# EasyEDA Pro project 灰度传感器_2024-07-25.epro

# Schematic v1
Create Date: 2023-07-21; Page Name: P1; Project Name: 【2023电赛】2023年电赛控制术; Schematic Name: v1; Update Date: 2023-07-31; Company: 桂林信息科技学院; Drawed: Jsir2022; Page Size: A4; Reviewed: QQ1171690935; Version: V1
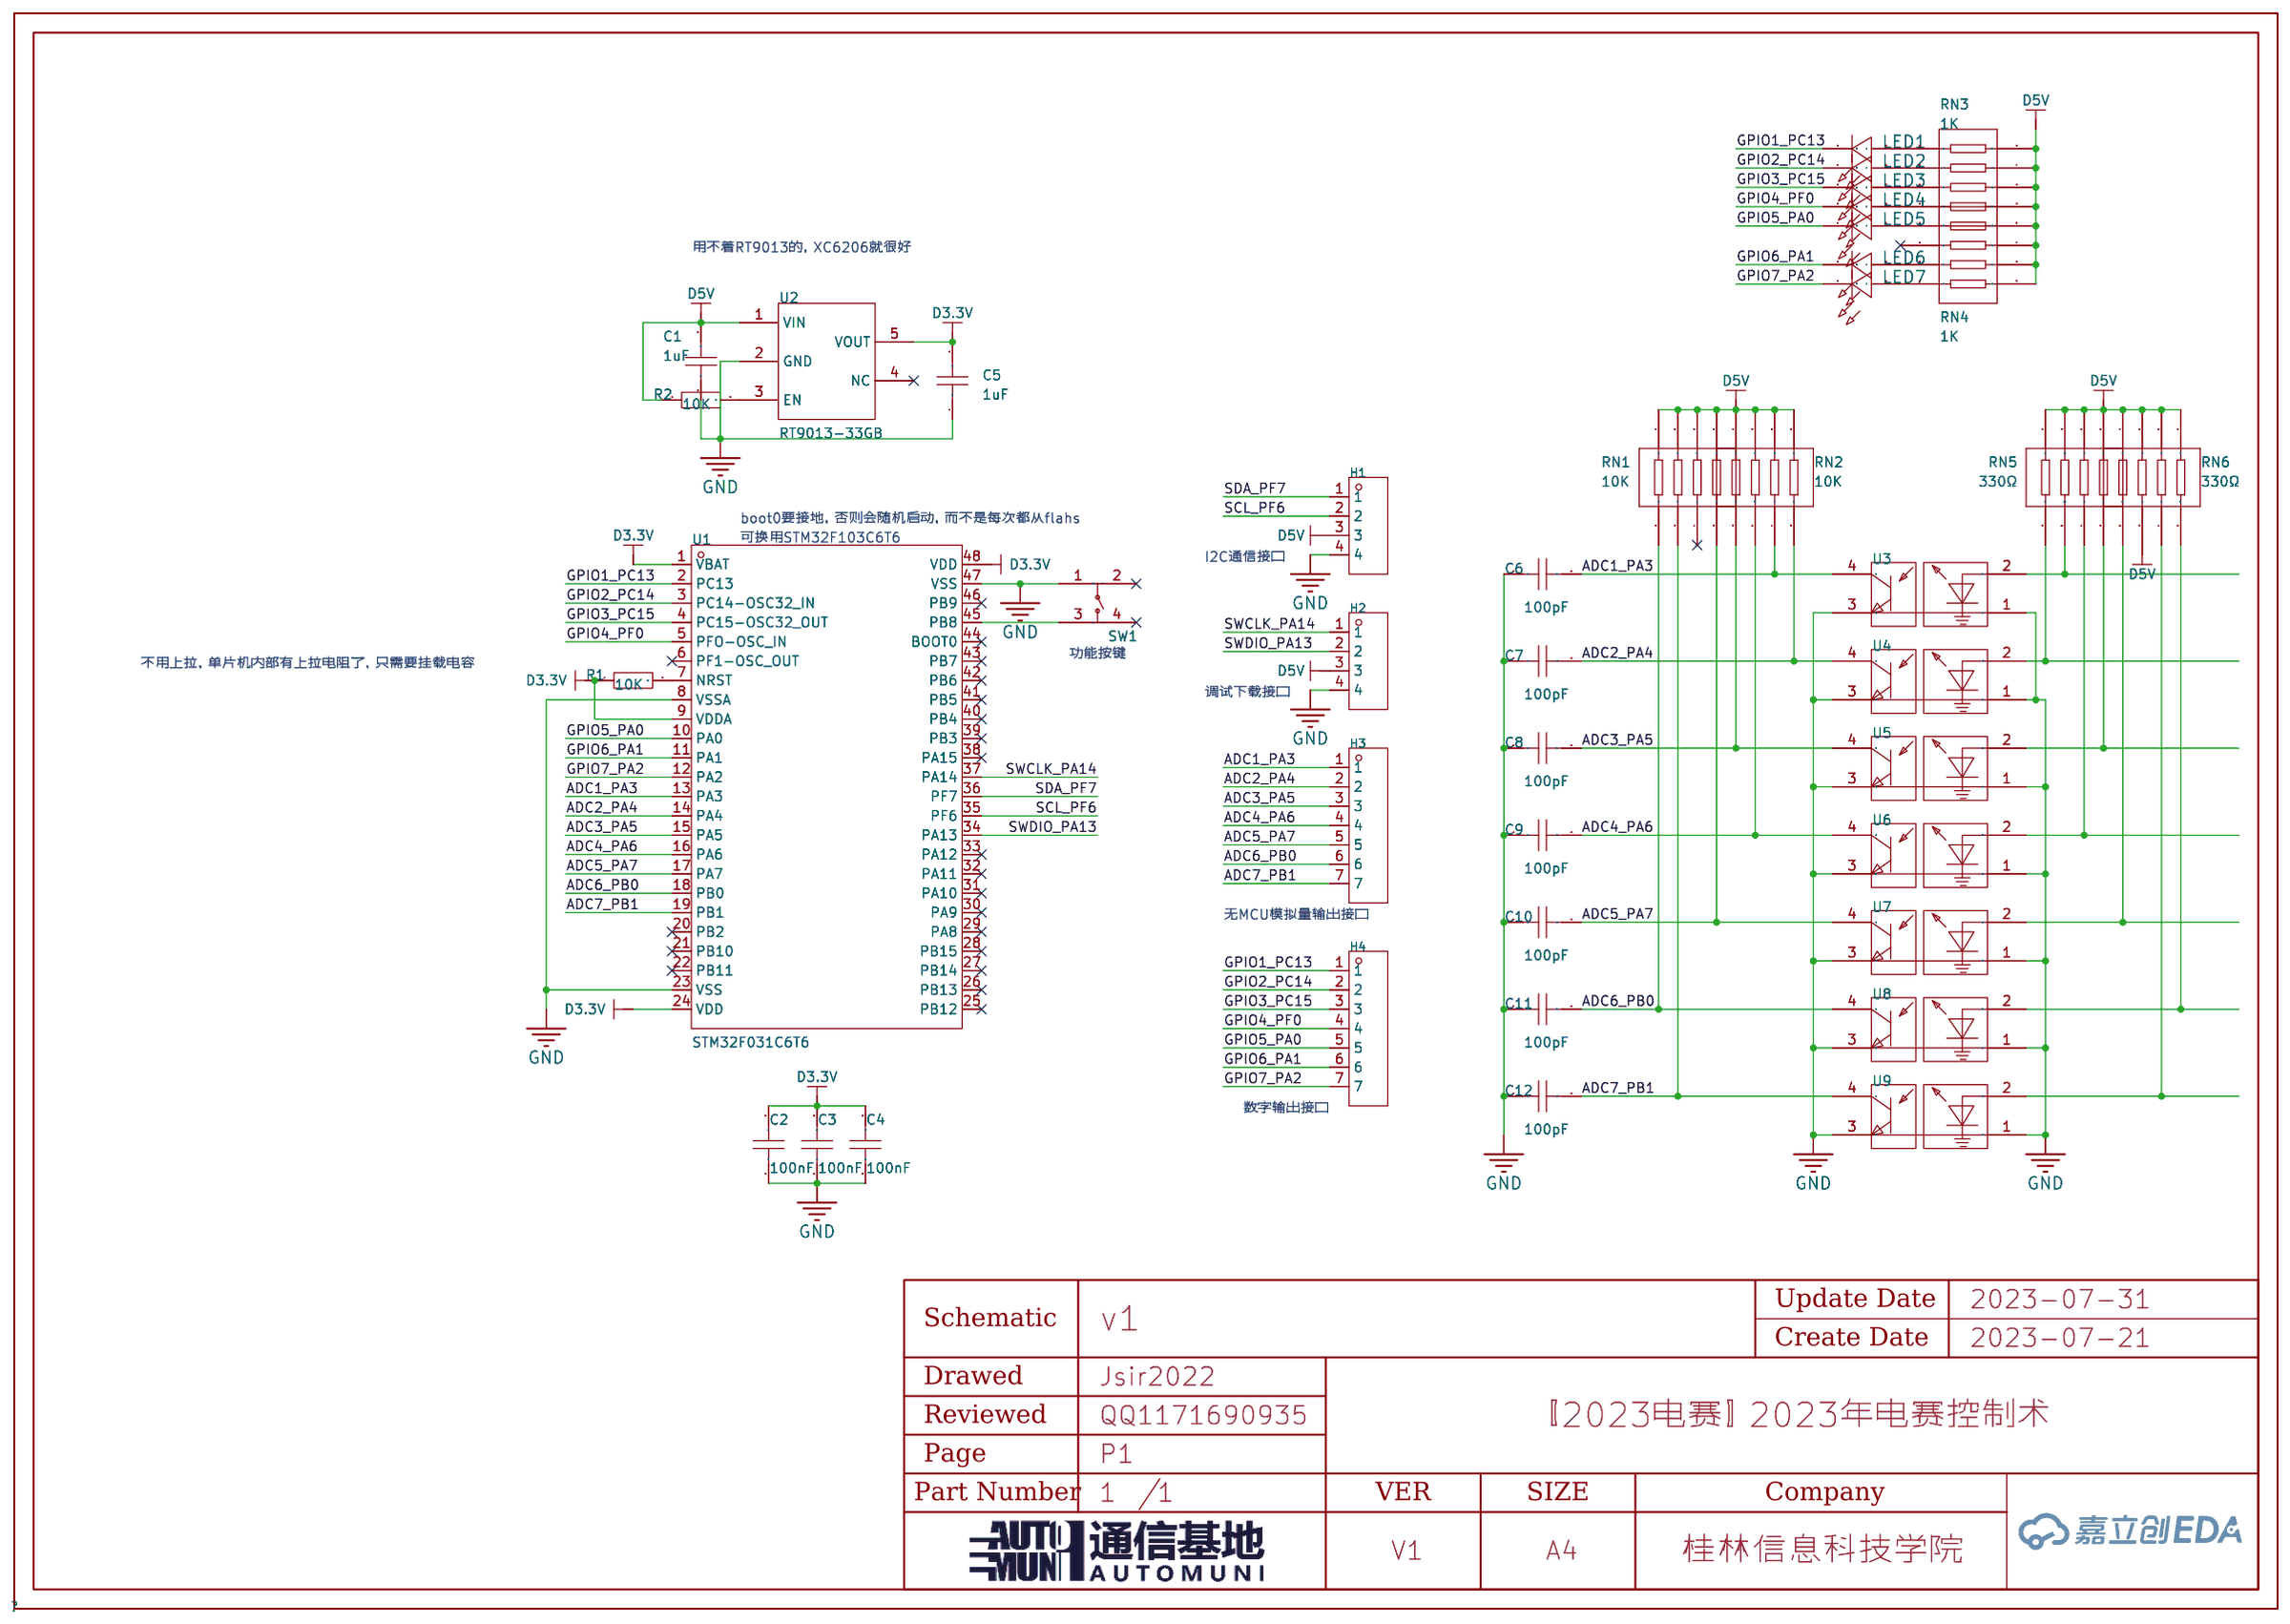
[diagram p0: schematic sheet]

## Parts
C1  1uF  [C0603]
C2  100nF  [C0603]
C3  100nF  [C0603]
C4  100nF  [C0603]
C5  1uF  [C0603]
C6  100pF  [C0603]
C7  100pF  [C0603]
C8  100pF  [C0603]
C9  100pF  [C0603]
C10  100pF  [C0603]
C11  100pF  [C0603]
C12  100pF  [C0603]
H1  -  [HDR-TH_4P-P2.54-V-M]
H2  -  [HDR-TH_4P-P2.54-V-M]
H3  -  [HDR-TH_7P-P2.54-V-M]
H4  -  [HDR-TH_7P-P2.54-V-M]
LED1  -  [LED_0603]
LED2  -  [LED_0603]
LED3  -  [LED_0603]
LED4  -  [LED_0603]
LED5  -  [LED_0603]
LED6  -  [LED_0603]
LED7  -  [LED_0603]
R1  10K  [R0603]
R2  10K  [R0603]
RN1  10K  [RES-ARRAY-SMD_0402-8P-L2.0-W1.0-BL]
RN2  10K  [RES-ARRAY-SMD_0402-8P-L2.0-W1.0-BL]
RN3  1K  [RES-ARRAY-SMD_0402-8P-L2.0-W1.0-BL]
RN4  1K  [RES-ARRAY-SMD_0402-8P-L2.0-W1.0-BL]
RN5  330Ω  [RES-ARRAY-SMD_0402-8P-L2.0-W1.0-BL]
RN6  330Ω  [RES-ARRAY-SMD_0402-8P-L2.0-W1.0-BL]
SW1  TS-1089S-AR02516  [SW-SMD_4P-L4.2-W3.3-P2.15-LS5.1]
U1  STM32F031C6T6  [LQFP-48_L7.0-W7.0-P0.50-LS9.0-BL]
U2  RT9013-33GB  [SOT-23-5_L3.0-W1.7-P0.95-LS2.8-BL]
U3  ITR9909  [OPTO-TH_ITR9909]
U4  ITR9909  [OPTO-TH_ITR9909]
U5  ITR9909  [OPTO-TH_ITR9909]
U6  ITR9909  [OPTO-TH_ITR9909]
U7  ITR9909  [OPTO-TH_ITR9909]
U8  ITR9909  [OPTO-TH_ITR9909]
U9  ITR9909  [OPTO-TH_ITR9909]

## Library data of the parts
C1-C12 = CAP_0603: Supplier Footprint: 0603
H1 H2 = HDR-M_2.54_1x4P: Supplier Part: C492403; Supplier Footprint: 插件
H3 H4 = HDR-M_2.54_1x7P: Supplier Part: C492406; Supplier Footprint: 插件
LED1-LED7 = LED_0603-R: Supplier Footprint: 0603
R1 R2 = Res_0603: Supplier Footprint: 0603
RN1-RN6 = YC124-JR-07330RL: 阻值:330Ω;精度:±5%;单个元件功率:62.5mW;电阻器数:4;; LCSC Part Name: 330Ω ±5% 0402x4; Supplier Part: C136846; Manufacturer: YAGEO(国巨); Supplier Footprint: 0402x4; JLCPCB Part Class: Extended Part; Datasheet: https://atta.szlcsc.com/upload/public/pdf/source/20171106/C136846_15099533593141092631.pdf; Supplier: LCSC; Tolerance: ±5%; Power(Watts): 62.5mW; Number of Resistors: 4; Number of Pins: 8; Temperature Coefficient: ±200ppm/℃
SW1 = TS-1089S-AR02516: 触点电流:50mA;额定电压(DC):12V;绝缘电阻:100MΩ;电路结构:单刀单掷;安装方式:立贴;按钮形状:椭圆形按钮;按钮/盖帽颜色:白色;作用力:160gf@±50gf;机械寿命:100000;工作温度:-30~+80;引脚样式:SMD接片;开关长度:4.2mm;开关宽度:3.25mm;开关高度:2.5mm;带支架:否;; LCSC Part Name: 342.5 160gf 轻触开关; Supplier Part: C720479; Manufacturer: XUNPU(讯普); Supplier Footprint: SMD; JLCPCB Part Class: Extended Part; Datasheet: https://atta.szlcsc.com/upload/public/pdf/source/20200810/C720479_389650BB8B865DD3822BD59B78D6CF64.pdf; Supplier: LCSC; Contact Current: 50mA; Voltage Rating (DC): 12V; Insulation Resistance: 100MΩ; Circuit: 单刀单掷; Mounting Style: 立贴; Actuator Style: 椭圆形按钮; Actuator/Cap Color: 白色; Operating Force: 160gf@±50gf; Mechanical Life: 100000; Operating Temperature: -30~+80; Pin Style: SMD接片; Switch Length: 4.2mm; Switch Width: 3.25mm; Switch Height: 2.5mm; Strike Gundam: 否
U1 = STM32F031C6T6: CPU内核:ARM Cortex-M0;CPU最大主频:48MHz;工作电压范围:2V~3.6V;内部振荡器:有;程序 FLASH容量:32K@x8bit;RAM总容量:4KB;EEPROM/数据 FLASH容量:-;GPIO端口数量:39;ADC(单元数/通道数/位数):1@x13ch/12bit;外设/功能/协议栈:DMA；看门狗；POR；PWM;工作温度范围:-40℃~+85℃;; LCSC Part Name: ARM Cortex-M0 48MHz 闪存：32K@x8bit RAM：4KB; Supplier Part: C97413; Manufacturer: ST(意法半导体); Supplier Footprint: LQFP-48(7x7); JLCPCB Part Class: Extended Part; Datasheet: https://atta.szlcsc.com/upload/public/pdf/source/20170925/C97413_1506321779757990583.pdf; Supplier: LCSC; CPU Core: ARM Cortex-M0; Maximum Frequency: 48MHz; Supply Voltage Range: 2V~3.6V; Internal Oscillator: 有; Program FLASH Size: 32K@x8bit; RAM Size: 4KB; GPIO Ports Number: 39; ADC (Units/Channels/bits): 1@x13ch/12bit; Peripherals / Functions / Protocol Stacks: DMA；看门狗；POR；PWM; Operating Temperature Range: -40℃~+85℃
U2 = RT9013-33GB: 输出类型:固定;输出极性:正;最大输入电压:5.5V;输出电压:3.3V;输出电流:500mA;电源纹波抑制比(PSRR):50dB@(10kHz);; Supplier Part: C47773; Manufacturer: RICHTEK(立锜); Supplier Footprint: SOT-23-5; JLCPCB Part Class: 扩展库; Datasheet: https://atta.szlcsc.com/upload/public/pdf/source/20150504/1457707282459.pdf; Supplier: LCSC; Output Type: 固定; Output Polarity: 正; Number of Outputs: 1; Maximum Input Voltage: 5.5V; Output Voltage: 3.3V; Dropout Voltage: 400mV@(500mA); Output Current: 500mA; Power Supply Rejection Ratio (PSRR): 50dB@(10kHz)
U3-U9 = ITR9909: Supplier Part: C53399; Manufacturer: EVERLIGHT(台湾亿光); Supplier Footprint: DIP-4; JLCPCB Part Class: Extended Part; Datasheet: https://atta.szlcsc.com/upload/public/pdf/source/20201022/C53399_E5C79523D84B21DC4419F8E709CCCF2E.pdf; Supplier: LCSC

## Nets
D3.3V: C2.2 C3.2 C4.2 C5.2 R1.1 U1.1(VBAT) U1.9(VDDA) U1.24(VDD) U1.48(VDD) U2.5(VOUT)
D5V: C1.2 H1.3 H2.3 R2.1 RN1.1 RN1.2 RN1.3 RN1.4 RN2.1 RN2.2 RN2.3 RN2.4 RN3.5 RN3.6 RN3.7 RN3.8 RN4.5 RN4.6 RN4.7 RN4.8 RN5.1 RN5.2 RN5.3 RN5.4 RN6.1 RN6.2 RN6.3 RN6.4 RN6.6 U2.1(VIN)
GND: C1.1 C2.1 C3.1 C4.1 C5.1 C6.1 C7.1 C8.1 C9.1 C10.1 C11.1 C12.1 H1.4 H2.4 SW1.1 U1.8(VSSA) U1.23(VSS) U1.47(VSS) U2.2(GND) U3.1 U3.3 U4.1 U4.3 U5.1 U5.3 U6.1 U6.3 U7.1 U7.3 U8.1 U8.3 U9.1 U9.3
ADC1_PA3: C6.2 H3.1 RN2.7 U1.13(PA3) U3.4
ADC2_PA4: C7.2 H3.2 RN2.8 U1.14(PA4) U4.4
ADC3_PA5: C8.2 H3.3 RN2.5 U1.15(PA5) U5.4
ADC4_PA6: C9.2 H3.4 RN2.6 U1.16(PA6) U6.4
ADC5_PA7: C10.2 H3.5 RN1.8 U1.17(PA7) U7.4
ADC6_PB0: C11.2 H3.6 RN1.5 U1.18(PB0) U8.4
ADC7_PB1: C12.2 H3.7 RN1.6 U1.19(PB1) U9.4
GPIO1_PC13: H4.1 LED1.1(C) U1.2(PC13)
GPIO2_PC14: H4.2 LED2.1(C) U1.3(PC14-OSC32_IN)
GPIO3_PC15: H4.3 LED3.1(C) U1.4(PC15-OSC32_OUT)
GPIO4_PF0: H4.4 LED4.1(C) U1.5(PFO-OSC_IN)
GPIO5_PA0: H4.5 LED5.1(C) U1.10(PA0)
GPIO6_PA1: H4.6 LED6.1(C) U1.11(PA1)
GPIO7_PA2: H4.7 LED7.1(C) U1.12(PA2)
SCL_PF6: H1.2 U1.35(PF6)
SDA_PF7: H1.1 U1.36(PF7)
SWCLK_PA14: H2.1 U1.37(PA14)
SWDIO_PA13: H2.2 U1.34(PA13)
$1N2447: R1.2 U1.7(NRST)
$1N4175: LED1.2(A) RN3.1
$1N4229: LED2.2(A) RN3.2
$1N4256: LED3.2(A) RN3.3
$1N4283: LED4.2(A) RN3.4
$1N4310: LED5.2(A) RN4.1
$1N5229: SW1.3 U1.45(PB8)
$1N5545: R2.2 U2.3(EN)
$1N6315: RN5.7 U6.2
$1N6322: RN5.8 U5.2
$1N6336: RN5.5 U4.2
$1N6418: RN5.6 U3.2
$1N6450: RN6.5 U7.2
$1N6471: RN6.8 U8.2
$1N6478: RN6.7 U9.2
$1N6514: LED7.2(A) RN4.4
$1N6542: LED6.2(A) RN4.3

Not connected (* = marked no-connect by the designer): RN1 7*; RN4 2*; SW1 2* 4*; U1 6(PF1-OSC_OUT)* 20(PB2)* 21(PB10)* 22(PB11)* 25(PB12)* 26(PB13)* 27(PB14)* 28(PB15)* 29(PA8)* 30(PA9)* 31(PA10)* 32(PA11)* 33(PA12)* 38(PA15)* 39(PB3)* 40(PB4)* 41(PB5)* 42(PB6)* 43(PB7)* 44(BOOT0)* 46(PB9)*; U2 4(NC)*

## Notes on the sheet
- 用不着RT9013的，XC6206就很好
- boot0要接地，否则会随机启动，而不是每次都从flahs
- 可换用STM32F103C6T6
- I2C通信接口
- 功能按键
- 不用上拉，单片机内部有上拉电阻了，只需要挂载电容
- 调试下载接口
- 无MCU模拟量输出接口
- 数字输出接口

# Schematic Schematic1
Create Date: 2024-07-11; Page Name: P1; Project Name: 灰度传感器; Schematic Name: Schematic1; Update Date: 2024-07-16; Company: 桂林信息科技学院; Drawed: Jsir2022; Page Size: A4; Reviewed: QQ1171690935; Version: V1
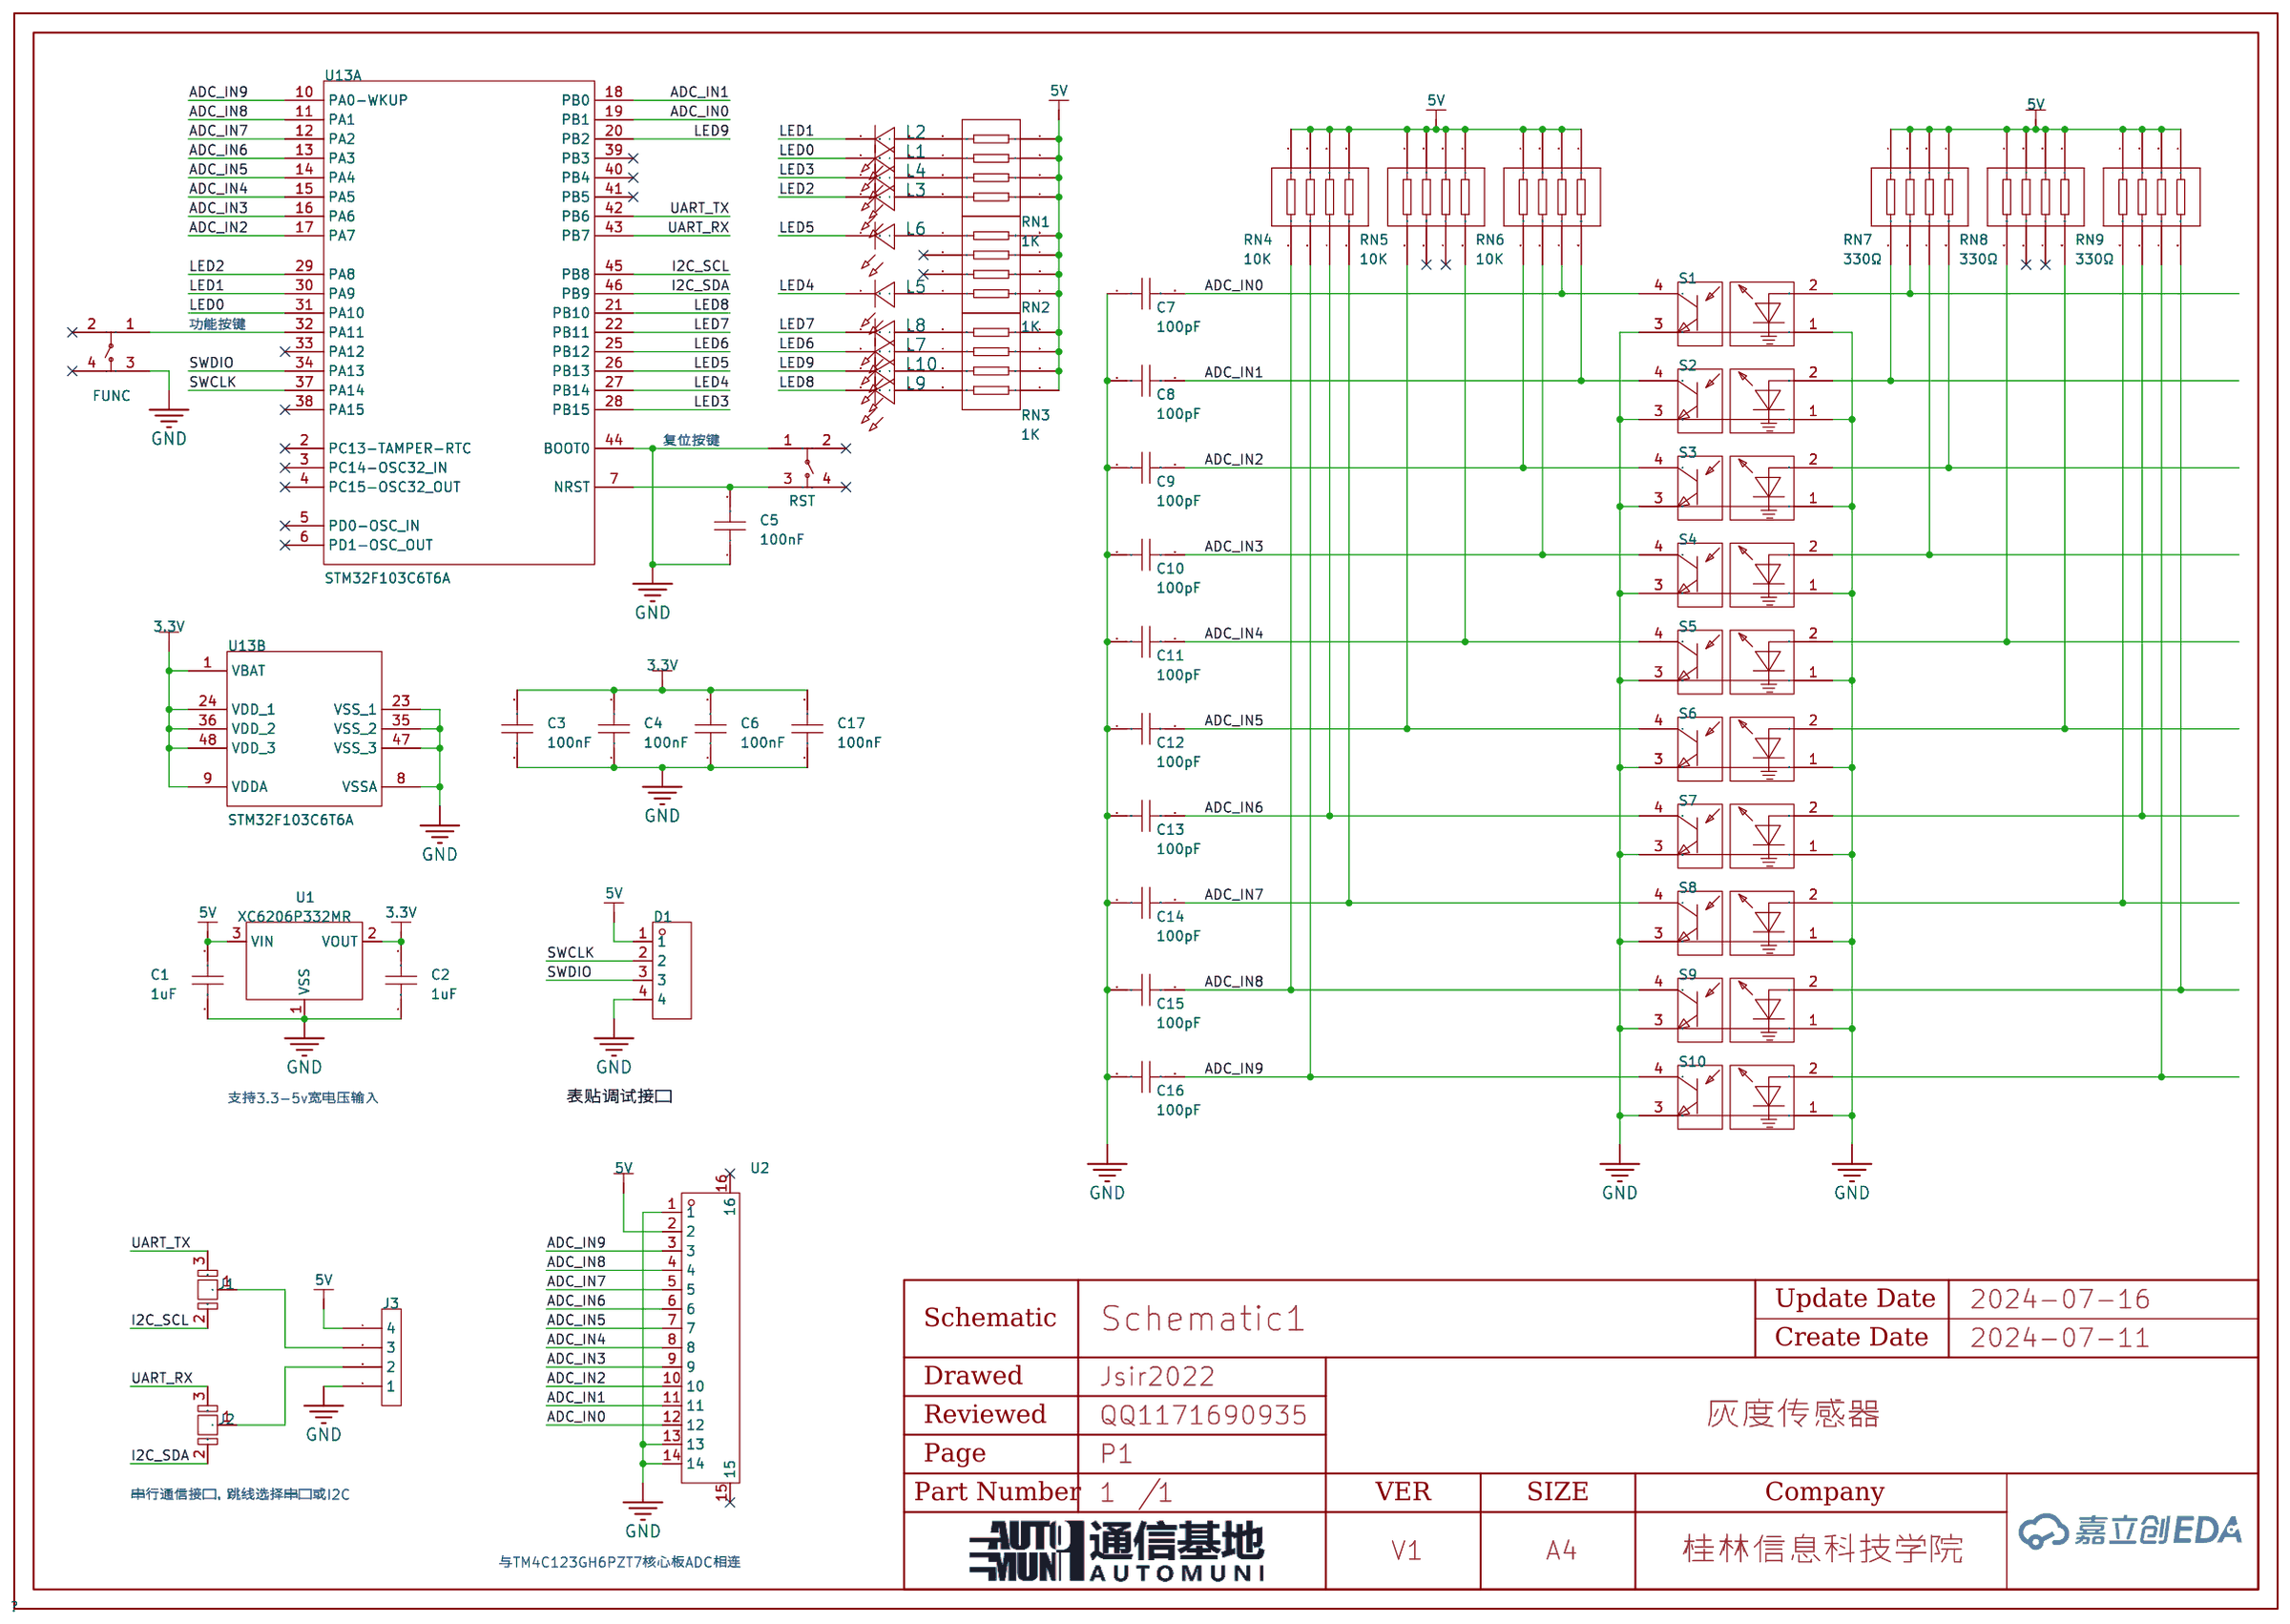
[diagram p1: schematic sheet]

## Parts
C1  1uF  [C0603]
C2  1uF  [C0603]
C3  100nF  [C0603]
C4  100nF  [C0603]
C5  100nF  [C0603]
C6  100nF  [C0603]
C7  100pF  [C0603]
C8  100pF  [C0603]
C9  100pF  [C0603]
C10  100pF  [C0603]
C11  100pF  [C0603]
C12  100pF  [C0603]
C13  100pF  [C0603]
C14  100pF  [C0603]
C15  100pF  [C0603]
C16  100pF  [C0603]
C17  100nF  [C0603]
D1  -  [2.54 4p 下载触点]
FUNC  TS-1089S-AR02516  [SW-SMD_4P-L4.2-W3.3-P2.15-LS5.1]
J1  -  [跳线焊盘3p]
J2  -  [跳线焊盘3p]
J3  -  [2.54 4P SMD]
L1  -  [LED_0603]
L2  -  [LED_0603]
L3  -  [LED_0603]
L4  -  [LED_0603]
L5  -  [LED_0603]
L6  -  [LED_0603]
L7  -  [LED_0603]
L8  -  [LED_0603]
L9  -  [LED_0603]
L10  -  [LED_0603]
RN1  1K  [RES-ARRAY-SMD_0402-8P-L2.0-W1.0-BL]
RN2  1K  [RES-ARRAY-SMD_0402-8P-L2.0-W1.0-BL]
RN3  1K  [RES-ARRAY-SMD_0402-8P-L2.0-W1.0-BL]
RN4  10K  [RES-ARRAY-SMD_0402-8P-L2.0-W1.0-BL]
RN5  10K  [RES-ARRAY-SMD_0402-8P-L2.0-W1.0-BL]
RN6  10K  [RES-ARRAY-SMD_0402-8P-L2.0-W1.0-BL]
RN7  330Ω  [RES-ARRAY-SMD_0402-8P-L2.0-W1.0-BL]
RN8  330Ω  [RES-ARRAY-SMD_0402-8P-L2.0-W1.0-BL]
RN9  330Ω  [RES-ARRAY-SMD_0402-8P-L2.0-W1.0-BL]
RST  TS-1089S-AR02516  [SW-SMD_4P-L4.2-W3.3-P2.15-LS5.1]
S1  ITR9909  [OPTO-TH_ITR9909]
S2  ITR9909  [OPTO-TH_ITR9909]
S3  ITR9909  [OPTO-TH_ITR9909]
S4  ITR9909  [OPTO-TH_ITR9909]
S5  ITR9909  [OPTO-TH_ITR9909]
S6  ITR9909  [OPTO-TH_ITR9909]
S7  ITR9909  [OPTO-TH_ITR9909]
S8  ITR9909  [OPTO-TH_ITR9909]
S9  ITR9909  [OPTO-TH_ITR9909]
S10  ITR9909  [OPTO-TH_ITR9909]
U1  XC6206P332MR  [SOT-23-3_L2.9-W1.3-P1.90-LS2.4-BR]
U2  FPC-1.0FX-14PWCR-H20  [FPC-SMD_XUNPU_FPC-1.0FX-14PWCR-H20]
U13  STM32F103C6T6A  [LQFP-48_L7.0-W7.0-P0.50-LS9.0-BL]  (sections 1,2)

## Library data of the parts
C1-C17 = CAP_0603: Supplier Footprint: 0603
D1 = 2.54 4p 下载触点
FUNC RST = TS-1089S-AR02516: 触点电流:50mA;额定电压(DC):12V;绝缘电阻:100MΩ;电路结构:单刀单掷;安装方式:立贴;按钮形状:椭圆形按钮;按钮/盖帽颜色:白色;作用力:160gf@±50gf;机械寿命:100000;工作温度:-30~+80;引脚样式:SMD接片;开关长度:4.2mm;开关宽度:3.25mm;开关高度:2.5mm;带支架:否;; LCSC Part Name: 342.5 160gf 轻触开关; Supplier Part: C720479; Manufacturer: XUNPU(讯普); Supplier Footprint: SMD; JLCPCB Part Class: Extended Part; Datasheet: https://atta.szlcsc.com/upload/public/pdf/source/20200810/C720479_389650BB8B865DD3822BD59B78D6CF64.pdf; Supplier: LCSC; Contact Current: 50mA; Voltage Rating (DC): 12V; Insulation Resistance: 100MΩ; Circuit: 单刀单掷; Mounting Style: 立贴; Actuator Style: 椭圆形按钮; Actuator/Cap Color: 白色; Operating Force: 160gf@±50gf; Mechanical Life: 100000; Operating Temperature: -30~+80; Pin Style: SMD接片; Switch Length: 4.2mm; Switch Width: 3.25mm; Switch Height: 2.5mm; Strike Gundam: 否
J1 J2 = 跳线焊盘3P
J3 = 2.54 4P排针表贴
L1-L10 = LED_0603-R: Supplier Footprint: 0603
RN1-RN9 = YC124-JR-07330RL: 阻值:330Ω;精度:±5%;单个元件功率:62.5mW;电阻器数:4;; LCSC Part Name: 330Ω ±5% 0402x4; Supplier Part: C136846; Manufacturer: YAGEO(国巨); Supplier Footprint: 0402x4; JLCPCB Part Class: Extended Part; Datasheet: https://atta.szlcsc.com/upload/public/pdf/source/20171106/C136846_15099533593141092631.pdf; Supplier: LCSC; Tolerance: ±5%; Power(Watts): 62.5mW; Number of Resistors: 4; Number of Pins: 8; Temperature Coefficient: ±200ppm/℃
S1-S10 = ITR9909: Supplier Part: C53399; Manufacturer: EVERLIGHT(台湾亿光); Supplier Footprint: DIP-4; JLCPCB Part Class: Extended Part; Datasheet: https://atta.szlcsc.com/upload/public/pdf/source/20201022/C53399_E5C79523D84B21DC4419F8E709CCCF2E.pdf; Supplier: LCSC
U1 = XC6206P332MR_C5148692: 输出类型:固定;最大输入电压:8V;输出电压:3.3V;最大输出电流:300mA;输出极性:正极;; LCSC Part Name: 输入8V 输出3.3V 300mA; Supplier Part: C5148692; Manufacturer: HXY MOSFET(华轩阳电子); Supplier Footprint: SOT-23; JLCPCB Part Class: 扩展库; Datasheet: https://atta.szlcsc.com/upload/public/pdf/source/20230315/7D5B35EFFBBF81C2EFC36318D2A1A670.pdf; Supplier: LCSC; Output Type: 固定; Maximum Input Voltage: 8V; Output Voltage: 3.3V; MAX Output Current: 300mA; Dropout Voltage: 240mV@(50mA); Output Polarity: 正极; Number of Outputs: 1
U2 = FPC-1.0FX-14PWCR-H20: 锁定特性:翻盖式;触点类型:下接;触点数量:14P;间距:1mm;安装类型:卧贴;; LCSC Part Name: 间距:1mm P数:14P 翻盖式 下接; Supplier Part: C19269357; Manufacturer: XUNPU(讯普); Supplier Footprint: SMD,P=1mm,卧贴; JLCPCB Part Class: 扩展库; Datasheet: https://atta.szlcsc.com/upload/public/pdf/source/20231121/46D1D420E162B395A0FFF09C3BB98E72.pdf; Supplier: LCSC; Locking Feature: 翻盖式; Contact Type: 下接; Number of Contacts: 14P; Pitch: 1mm; Mounting Type: 卧贴; Height Above Board: 2mm
U13 = STM32F103C6T6A: CPU内核:CM3;程序存储容量:32KB;RAM总容量:10KB;GPIO端口数量:37;工作电压范围:2V~3.6V;CPU最大主频:72MHz;程序存储器类型:FLASH;; Supplier Part: C8303; Manufacturer: ST(意法半导体); Supplier Footprint: LQFP-48(7x7); JLCPCB Part Class: 扩展库; Datasheet: https://atta.szlcsc.com/upload/public/pdf/source/20140724/1457707171306.pdf; Supplier: LCSC; CPU Core: CM3; Program Storage Size: 32KB; RAM Size: 10KB; GPIO Ports Number: 37; Operating Voltage Range: 2V~3.6V; CPU Maximum Speed: 72MHz; Program Memory Type: FLASH; Operating Temperature Range: -40℃~+85℃; ADC (Bit): 12bit; Universal Serial Bus: 有; Peripheral/Function: DMA；片载温度传感器；PWM; Watchdog: 有; Infrared Data Association: 有; Low-Voltage Detect: 有; Direct Memory Access: 有; Internal Oscillator: 有

## Nets
3.3V: C2.2 C3.2 C4.2 C6.2 C17.2 U1.2(VOUT) U13.1(VBAT) U13.9(VDDA) U13.24(VDD_1) U13.36(VDD_2) U13.48(VDD_3)
5V: C1.2 D1.1 J3.4 RN1.1 RN1.2 RN1.3 RN1.4 RN2.5 RN2.6 RN2.7 RN2.8 RN3.1 RN3.2 RN3.3 RN3.4 RN4.1 RN4.2 RN4.3 RN4.4 RN5.1 RN5.2 RN5.3 RN5.4 RN6.1 RN6.2 RN6.3 RN6.4 RN7.1 RN7.2 RN7.3 RN7.4 RN8.1 RN8.2 RN8.3 RN8.4 RN9.1 RN9.2 RN9.3 RN9.4 U1.3(VIN) U2.2
GND: C1.1 C2.1 C3.1 C4.1 C5.1 C6.1 C7.1 C8.1 C9.1 C10.1 C11.1 C12.1 C13.1 C14.1 C15.1 C16.1 C17.1 D1.4 FUNC.3 J3.1 RST.1 S1.1 S1.3 S2.1 S2.3 S3.1 S3.3 S4.1 S4.3 S5.1 S5.3 S6.1 S6.3 S7.1 S7.3 S8.1 S8.3 S9.1 S9.3 S10.1 S10.3 U1.1(VSS) U2.1 U2.13 U2.14 U13.8(VSSA) U13.23(VSS_1) U13.35(VSS_2) U13.44(BOOT0) U13.47(VSS_3)
ADC_IN0: C7.2 RN6.7 S1.4 U2.12 U13.19(PB1)
ADC_IN1: C8.2 RN6.8 S2.4 U2.11 U13.18(PB0)
ADC_IN2: C9.2 RN6.5 S3.4 U2.10 U13.17(PA7)
ADC_IN3: C10.2 RN6.6 S4.4 U2.9 U13.16(PA6)
ADC_IN4: C11.2 RN5.8 S5.4 U2.8 U13.15(PA5)
ADC_IN5: C12.2 RN5.5 S6.4 U2.7 U13.14(PA4)
ADC_IN6: C13.2 RN4.7 S7.4 U2.6 U13.13(PA3)
ADC_IN7: C14.2 RN4.8 S8.4 U2.5 U13.12(PA2)
ADC_IN8: C15.2 RN4.5 S9.4 U2.4 U13.11(PA1)
ADC_IN9: C16.2 RN4.6 S10.4 U2.3 U13.10(PA0-WKUP)
I2C_SCL: J1.2 U13.45(PB8)
I2C_SDA: J2.2 U13.46(PB9)
LED0: L1.1(C) U13.31(PA10)
LED1: L2.1(C) U13.30(PA9)
LED2: L3.1(C) U13.29(PA8)
LED3: L4.1(C) U13.28(PB15)
LED4: L5.1(C) U13.27(PB14)
LED5: L6.1(C) U13.26(PB13)
LED6: L7.1(C) U13.25(PB12)
LED7: L8.1(C) U13.22(PB11)
LED8: L9.1(C) U13.21(PB10)
LED9: L10.1(C) U13.20(PB2)
SWCLK: D1.2 U13.37(PA14)
SWDIO: D1.3 U13.34(PA13)
UART_RX: J2.3 U13.43(PB7)
UART_TX: J1.3 U13.42(PB6)
$1N7041: C5.2 RST.3 U13.7(NRST)
$1N7104: FUNC.1 U13.32(PA11)
$1N7880: J2.1 J3.2
$1N7885: J1.1 J3.3
$1N11035: RN8.8 S6.2
$1N11042: RN8.5 S5.2
$1N11122: RN9.5 S8.2
$1N11129: RN9.6 S7.2
$1N11138: RN9.7 S10.2
$1N11160: RN9.8 S9.2
$1N11201: RN7.5 S2.2
$1N11208: RN7.6 S1.2
$1N11217: RN7.7 S4.2
$1N11224: RN7.8 S3.2
$1N12791: L2.2(A) RN1.8
$1N12820: L1.2(A) RN1.7
$1N12849: L3.2(A) RN1.5
$1N12851: L4.2(A) RN1.6
$1N12907: L6.2(A) RN2.1
$1N12909: L5.2(A) RN2.4
$1N13108: L7.2(A) RN3.7
$1N13110: L8.2(A) RN3.8
$1N13112: L9.2(A) RN3.5
$1N13114: L10.2(A) RN3.6

Not connected (* = marked no-connect by the designer): FUNC 2* 4*; RN2 2* 3*; RN5 6* 7*; RN8 6* 7*; RST 2* 4*; U2 15* 16*; U13 2(PC13-TAMPER-RTC)* 3(PC14-OSC32_IN)* 4(PC15-OSC32_OUT)* 5(PD0-OSC_IN)* 6(PD1-OSC_OUT)* 33(PA12)* 38(PA15)* 39(PB3)* 40(PB4)* 41(PB5)*

## Notes on the sheet
- 功能按键
- 复位按键
- 支持3.3-5v宽电压输入
- 表贴调试接口
- 串行通信接口，跳线选择串口或I2C
- 与TM4C123GH6PZT7核心板ADC相连

# Board V2
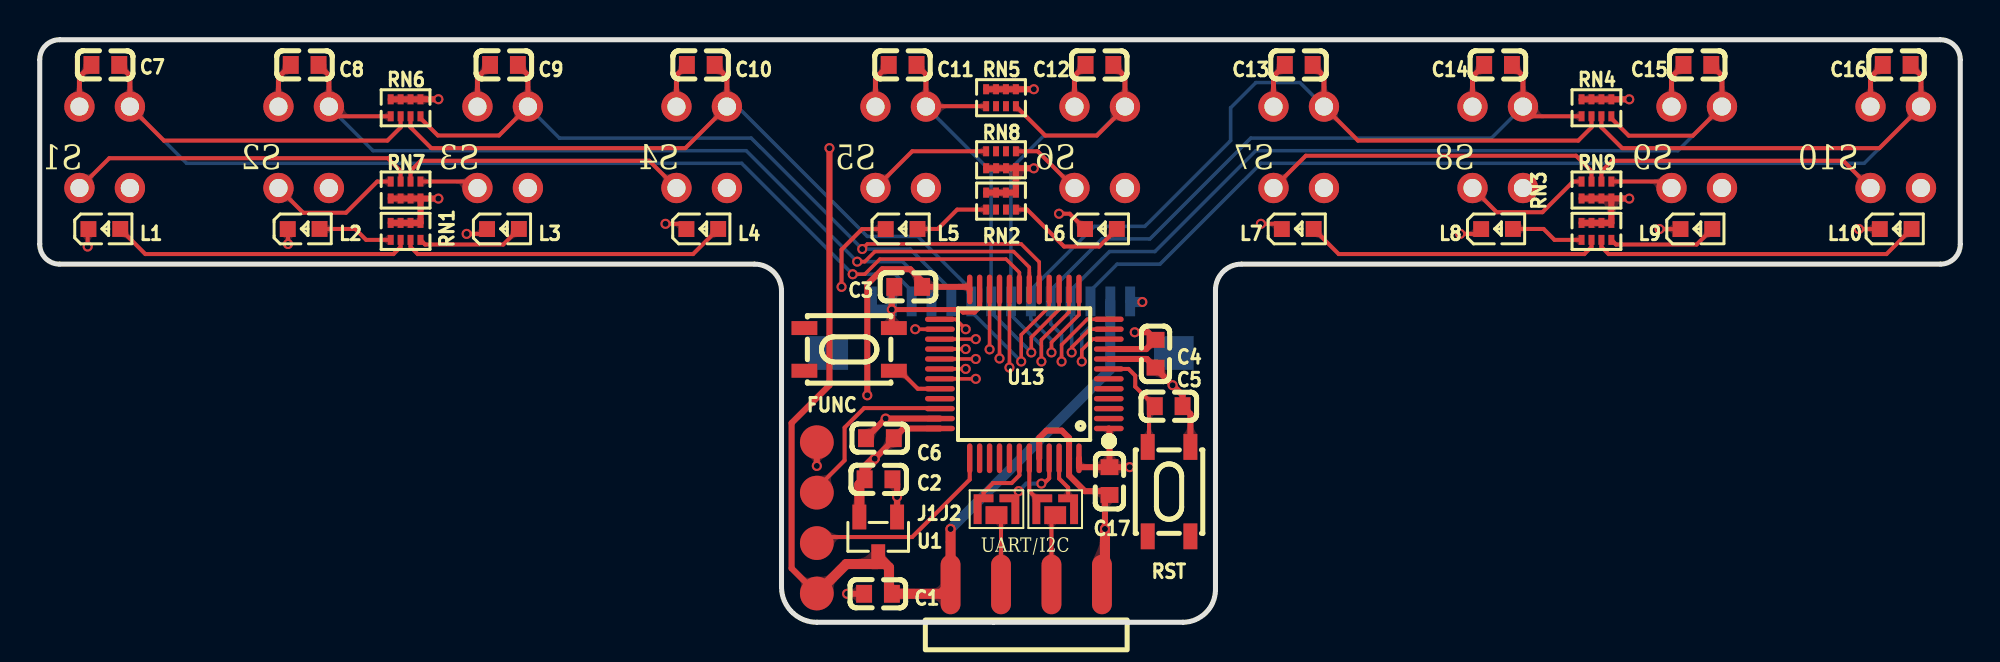
[diagram p2: board, top side]
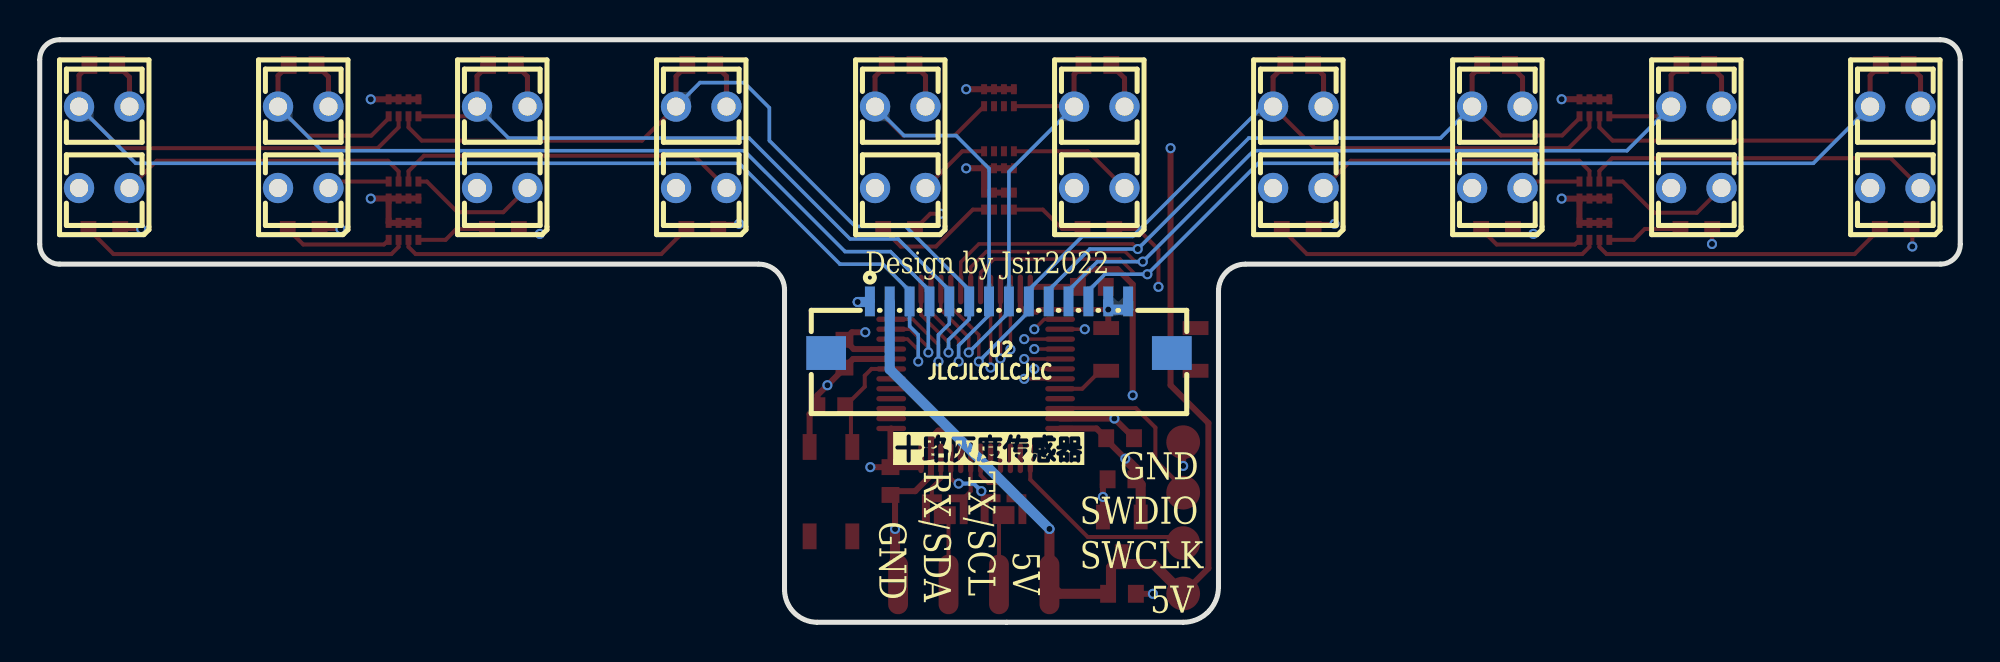
[diagram p3: board, bottom side, seen from below]

Outline 96.67 x 29.34 mm; copper layers: Top Layer, Inner1, Inner2, Bottom Layer. Coordinates in mm from the lower left corner of the outline.
Outline path: 0,28.34 arc(0.29,29.04) 1,29.34 95.67,29.34 arc(96.38,29.04) 96.67,28.34 96.67,19.04 arc(96.38,18.33) 95.67,18.04 60.49,18.04 arc(59.56,17.65) 59.18,16.73 59.18,1.65 arc(58.7,0.48) 57.53,0 39.12,0 arc(37.86,0.52) 37.34,1.78 37.34,16.68 arc(36.94,17.64) 35.98,18.04 1,18.04 arc(0.29,18.33) 0,19.04 0,28.34
Stack: Top Layer 0.035mm 外层铜厚1oz / Dielectric1 0.2104mm 7628 RC49% 8.6mil / Inner1 0.0152mm 内层铜厚 / Dielectric2 1.065mm 1.1mm H/HOZ 含铜 / Inner2 0.0152mm 内层铜厚 / Dielectric3 0.2104mm 7628 RC49% 8.6mil / Bottom Layer 0.035mm 外层铜厚1oz

## Design rules (mm)
template: JLCPCB Capability(Two Layers Board)
spacing copperThickness1oz (default): track to track 0.102, other pairs 0.152 to 0.3
spacing copperThickness2oz: track to track 0.203, other pairs 0.152 to 0.3
track width copperThickness1oz (default): min 0.127, default 0.254, max 2.54
track width copperThickness2oz: min 0.203, default 0.254, max 2.54
differential pair differentialPair (default): width min 0.127, default 0.254, max 2.54; gap min 0.152, default 0.152
via viaSize (default): diameter min 0.5, default 0.61, max 10; hole min 0.3, default 0.305, max 6.3

## Placement (name value [footprint] x y rotation side)
C1  1uF  [C0603]  42.2 1.43 0 top
C2  1uF  [C0603]  42.22 7.2 180 top
C3  100nF  [C0603]  43.71 16.89 0 top
C4  100nF  [C0603]  56.17 13.52 90 top
C5  100nF  [C0603]  56.83 10.88 180 top
C6  100nF  [C0603]  42.29 9.27 0 top
C7  100pF  [C0603]  3.3 28.07 0 top
C8  100pF  [C0603]  13.34 28.07 0 top
C9  100pF  [C0603]  23.37 28.07 0 top
C10  100pF  [C0603]  33.27 28.07 0 top
C11  100pF  [C0603]  43.43 28.07 0 top
C12  100pF  [C0603]  53.34 28.07 0 top
C13  100pF  [C0603]  63.37 28.07 0 top
C14  100pF  [C0603]  73.41 28.07 0 top
C15  100pF  [C0603]  83.44 28.07 0 top
C16  100pF  [C0603]  93.47 28.07 0 top
C17  100nF  [C0603]  53.85 7.11 90 top
D1  -  [2.54 4p 下载触点]  39.12 5.26 90 top
FUNC  TS-1089S-AR02516  [SW-SMD_4P-L4.2-W3.3-P2.15-LS5.1]  40.74 13.74 180 top
J1  -  [跳线焊盘3p]  49.51 4.74 180 top
J2  -  [跳线焊盘3p]  52.46 4.74 180 top
J3  -  [2.54 4P SMD]  49.66 1.91 270 top
L1  -  [LED_0603]  3.3 19.81 0 top
L2  -  [LED_0603]  13.34 19.81 0 top
L3  -  [LED_0603]  23.37 19.81 0 top
L4  -  [LED_0603]  33.4 19.81 0 top
L5  -  [LED_0603]  43.43 19.81 0 top
L6  -  [LED_0603]  53.47 19.81 0 top
L7  -  [LED_0603]  63.37 19.81 0 top
L8  -  [LED_0603]  73.41 19.81 0 top
L9  -  [LED_0603]  83.44 19.81 0 top
L10  -  [LED_0603]  93.47 19.81 0 top
RN1  1K  [RES-ARRAY-SMD_0402-8P-L2.0-W1.0-BL]  18.42 19.69 0 top
RN2  1K  [RES-ARRAY-SMD_0402-8P-L2.0-W1.0-BL]  48.39 21.21 180 top
RN3  1K  [RES-ARRAY-SMD_0402-8P-L2.0-W1.0-BL]  78.36 19.69 0 top
RN4  10K  [RES-ARRAY-SMD_0402-8P-L2.0-W1.0-BL]  78.36 25.91 0 top
RN5  10K  [RES-ARRAY-SMD_0402-8P-L2.0-W1.0-BL]  48.39 26.42 0 top
RN6  10K  [RES-ARRAY-SMD_0402-8P-L2.0-W1.0-BL]  18.42 25.91 0 top
RN7  330Ω  [RES-ARRAY-SMD_0402-8P-L2.0-W1.0-BL]  18.42 21.77 180 top
RN8  330Ω  [RES-ARRAY-SMD_0402-8P-L2.0-W1.0-BL]  48.39 23.29 180 top
RN9  330Ω  [RES-ARRAY-SMD_0402-8P-L2.0-W1.0-BL]  78.36 21.77 180 top
RST  TS-1089S-AR02516  [SW-SMD_4P-L4.2-W3.3-P2.15-LS5.1]  56.85 6.58 270 top
S1  ITR9909  [OPTO-TH_ITR9909]  3.27 23.92 90 bottom
S2  ITR9909  [OPTO-TH_ITR9909]  13.29 23.92 90 bottom
S3  ITR9909  [OPTO-TH_ITR9909]  23.3 23.92 90 bottom
S4  ITR9909  [OPTO-TH_ITR9909]  33.32 23.92 90 bottom
S5  ITR9909  [OPTO-TH_ITR9909]  43.34 23.92 90 bottom
S6  ITR9909  [OPTO-TH_ITR9909]  53.36 23.92 90 bottom
S7  ITR9909  [OPTO-TH_ITR9909]  63.37 23.92 90 bottom
S8  ITR9909  [OPTO-TH_ITR9909]  73.39 23.92 90 bottom
S9  ITR9909  [OPTO-TH_ITR9909]  83.41 23.92 90 bottom
S10  ITR9909  [OPTO-TH_ITR9909]  93.42 23.92 90 bottom
U1  XC6206P332MR  [SOT-23-3_L2.9-W1.3-P1.90-LS2.4-BR]  42.21 4.3 90 top
U2  FPC-1.0FX-14PWCR-H20  [FPC-SMD_XUNPU_FPC-1.0FX-14PWCR-H20]  48.39 14.86 180 bottom
U13  STM32F103C6T6A  [LQFP-48_L7.0-W7.0-P0.50-LS9.0-BL]  49.56 12.51 90 top

## Footprints (pads in the part's own frame, mm; a bottom-side part is the same pattern mirrored in y, then rotated)
2.54 4P SMD
  oval 3x1 smd: 1(0,3.81) 2(0,1.27) 3(0,-1.27) 4(0,-3.81)
2.54 4p 下载触点
  round 1.7 smd: 1(-3.81,0) 2(-1.27,0) 3(1.27,0) 4(3.81,0)
C0603
  rect 0.8x0.9 smd: 1(-0.7,0) 2(0.7,0)
FPC-SMD_XUNPU_FPC-1.0FX-14PWCR-H20
  rect 0.5x1.5 smd: 1(-6.5,1.3) 2(-5.5,1.3) 3(-4.5,1.3) 4(-3.5,1.3) 5(-2.5,1.3) 6(-1.5,1.3) 7(-0.5,1.3) 8(0.5,1.3) 9(1.5,1.3) 10(2.5,1.3) 11(3.5,1.3) 12(4.5,1.3) 13(5.5,1.3) 14(6.5,1.3)
  rect 2x1.7 smd: 15(8.7,-1.3) 16(-8.7,-1.3)
LED_0603
  rect 0.8x0.8 smd: 1(-0.851,-0.01) 2(0.75,-0.005)
LQFP-48_L7.0-W7.0-P0.50-LS9.0-BL
  oval 0.27x1.5 smd: 1(-2.75,-4.25) 2(-2.25,-4.25) 3(-1.75,-4.25) 4(-1.25,-4.25) 5(-0.75,-4.25) 6(-0.25,-4.25) 7(0.25,-4.25) 8(0.75,-4.25) 9(1.25,-4.25) 10(1.75,-4.25) 11(2.25,-4.25) 12(2.75,-4.25) 25(2.75,4.25) 26(2.25,4.25) 27(1.75,4.25) 28(1.25,4.25) 29(0.75,4.25) 30(0.25,4.25) 31(-0.25,4.25) 32(-0.75,4.25) 33(-1.25,4.25) 34(-1.75,4.25) 35(-2.25,4.25) 36(-2.75,4.25)
  oval 1.5x0.27 smd: 13(4.25,-2.75) 14(4.25,-2.25) 15(4.25,-1.75) 16(4.25,-1.25) 17(4.25,-0.75) 18(4.25,-0.25) 19(4.25,0.25) 20(4.25,0.75) 21(4.25,1.25) 22(4.25,1.75) 23(4.25,2.25) 24(4.25,2.75) 37(-4.25,2.75) 38(-4.25,2.25) 39(-4.25,1.75) 40(-4.25,1.25) 41(-4.25,0.75) 42(-4.25,0.25) 43(-4.25,-0.25) 44(-4.25,-0.75) 45(-4.25,-1.25) 46(-4.25,-1.75) 47(-4.25,-2.25) 48(-4.25,-2.75)
OPTO-TH_ITR9909
  round 1.524 hole 0.914: 1(-2.05,1.27) 2(-2.05,-1.27) 3(2.05,-1.27) 4(2.05,1.27)
RES-ARRAY-SMD_0402-8P-L2.0-W1.0-BL
  rect 0.3x0.505 smd: 1(-0.75,0.427) 2(-0.25,0.427) 3(0.25,0.427) 4(0.75,0.427) 5(0.75,-0.427) 6(0.25,-0.427) 7(-0.25,-0.427) 8(-0.75,-0.427)
SOT-23-3_L2.9-W1.3-P1.90-LS2.4-BR
  rect 1.25x0.7 smd: 1(1,-0.95) 2(1,0.95) 3(-1,0)
SW-SMD_4P-L4.2-W3.3-P2.15-LS5.1
  rect 1.3x0.701 smd: 1(-2.251,1.075) 2(2.251,1.075) 3(-2.251,-1.075) 4(2.251,-1.075)
跳线焊盘3p
  custom 1.1x0.9 smd: 1(1.35,-0.65)
  custom 1x1.5 smd: 2(0.7,-1.5) 3(2,-1.5)

## Nets
As in the schematic.

Pads without a net: FUNC 2 4; RN2 2 3; RN5 6 7; RN8 6 7; RST 2 4; U2 15 16; U13 2 3 4 5 6 33 38 39 40 41

## Via types
v1: diameter 0.508, hole 0.305, Top Layer to Bottom Layer, 52 vias

## Routing (per net, layer and track width the routed paths; a pad name or vN(x,y) marks a point on that pad's centre or on a via; arc(x,y) is an arc through that point)
3.3V: length 50.8
  Top Layer w0.305: C17.2 53.85,9.72 U13.1 ; C17.2 52.31,7.81 U13.48 ; C17.2 v1(54.86,7.81) ; v1(41.66,11.43) 41.66,17.02 42.42,17.78 43.82,17.78 44.41,17.18 C3.2 46.68,16.89 U13.24 ; v1(42.03,8.24) 42.99,9.2 C6.2 43.48,9.76 U13.36 ; v1(55.12,14.6) 55.79,14.6 C4.2 55.7,13.76 U13.9
  Top Layer w0.508: v1(42.03,8.24) 41.52,7.73 C2.2 41.26,6.94 U1.2
  Inner1 w0.508: v1(41.66,11.43) 41.66,8.61 v1(42.03,8.24) 42.45,7.81 v1(54.86,7.81) 54.86,14.35 v1(55.12,14.6)
5V: length 147
  Top Layer w0.305: D1.1 37.85,2.72 37.85,10.03 39.75,11.94 v1(39.75,23.88) ; RN8.1 RN2.8 RN2.7 RN2.6 RN2.5 ; RN8.1 50.03,22.86 v1(50.04,22.86) ; RN8.1 RN8.2 RN8.3 RN8.4 ; v1(20.07,26.34) 19.17,26.34 RN6.4 RN6.3 RN6.2 RN6.1 ; v1(50.04,26.84) RN5.4 RN5.3 RN5.2 RN5.1 ; RN1.1 RN1.2 RN1.3 RN1.4 19.17,20.12 19.17,21.34 ; RN3.1 RN3.2 RN3.3 RN3.4 RN9.1 ; RN4.1 RN4.2 RN4.3 RN4.4 v1(80.01,26.34) ; 19.17,21.34 RN7.1 RN7.2 RN7.3 RN7.4 ; 19.17,21.34 v1(20.07,21.34) ; RN9.1 RN9.2 RN9.3 RN9.4 ; RN9.1 80.01,21.34 v1(80.01,21.34)
  Top Layer w0.508: D1.1 40.6,2.93 42.16,2.93 42.21,2.98 U1.3 42.75,2.76 42.75,1.58 ; C1.2 45.38,1.43 J3.4 v1(45.85,4.7)
  Inner1 w0.508: 50.04,23.84 v1(50.04,26.84) ; 50.04,23.84 50.01,23.88 v1(39.75,23.88) 20.1,23.88 20.07,23.84 ; 50.04,23.84 50.04,23.84 ; 80.01,23.84 v1(80.01,26.34) ; 80.01,23.84 v1(80.01,21.34) ; 80.01,23.84 50.04,23.84 50.04,23.84 ; 50.04,23.84 v1(50.04,22.86) ; 20.07,23.84 v1(20.07,26.34) ; 20.07,23.84 v1(20.07,21.34)
  Bottom Layer w0.508: U2.2 53.89,12.74 v1(45.85,4.7)
GND: length 60.8
  Top Layer w0.254: C14.1 72.12,27.48 72.12,25.97 ; 82.14,25.97 82.14,27.47 C15.1 ; C9.1 22.03,27.43 22.03,25.97 ; C13.1 62.1,27.5 62.1,25.97 ; C7.1 2,27.46 2,25.97 ; 42.07,25.97 42.07,27.4 C11.1 ; 52.09,25.97 52.09,27.51 C12.1 ; C16.1 92.16,27.45 92.16,25.97 ; C8.1 12.02,27.45 12.02,25.97 ; U13.23 47.31,15.88 47.05,15.62 46.48,15.62 46.36,15.75 v1(42.89,15.75) ; C10.1 32.05,27.54 32.05,25.97
  Top Layer w0.305: RST.1 57.92,10.49 C5.1 57.53,11.44 v1(57.02,11.94) 56.17,12.8 C4.1 55.73,13.26 U13.8 ; C6.1 v1(42.58,10.26) U13.35 ; C2.1 43.16,6.97 v1(43.16,6.31) U1.1 ; v1(53.62,4.7) 53.62,6.18 C17.1 53.66,6.6 52.6,6.6 51.81,7.4 U13.47 51.81,9.28 51.44,9.65 50.68,9.65 50.31,9.28 U13.44 ; FUNC.3 42.89,14.92 v1(42.89,15.75) 42.89,16.77 C3.1 ; C1.1 v1(40.64,1.43) ; D1.4 v1(39.12,7.87)
  Top Layer w0.508: J3.1 53.62,2.06 v1(53.62,4.7)
  Bottom Layer w0.508: v1(55.5,16.13) 54.92,16.13 U2.1 ; U2.14 41.89,15.75 v1(42.89,15.75) U2.13
ADC_IN0: length 71.1
  Top Layer w0.178: v1(40.92,17.53) 41.53,17.53 42.29,18.29 48.64,18.29 49.31,17.62 U13.19
  Top Layer w0.203: 4.54,25.97 6.25,24.26 17.5,24.26 18.17,24.92 RN6.7
  Top Layer w0.254: C7.2 4.54,27.53 4.54,25.97
  Bottom Layer w0.178: U2.12 43.89,16.69 43.05,17.53 v1(40.92,17.53) 35.33,23.11 7.39,23.11 4.54,25.97
ADC_IN1: length 50.7
  Top Layer w0.178: v1(41.15,18.16) 41.53,18.16 42.04,18.67 49.02,18.67 49.81,17.88 U13.18
  Top Layer w0.203: RN6.8 15.04,25.48 14.56,25.97
  Top Layer w0.254: C8.2 14.56,27.55 14.56,25.97
  Bottom Layer w0.178: U2.11 44.89,16.71 43.43,18.16 v1(41.15,18.16) 35.56,23.75 16.78,23.75 14.56,25.97
ADC_IN2: length 45.3
  Top Layer w0.178: v1(41.4,18.8) 41.66,19.05 49.4,19.05 50.31,18.14 U13.17
  Top Layer w0.203: RN6.5 19.17,25.39 20.04,24.52 23.12,24.52 24.57,25.97
  Top Layer w0.254: 24.57,25.97 24.57,27.56 24.07,28.07
  Bottom Layer w0.178: 24.57,25.97 26.16,24.38 35.81,24.38 v1(41.4,18.8) 43.82,18.8 45.89,16.72 U2.10
ADC_IN3: length 45.1
  Top Layer w0.178: U13.16 50.81,15.89 49.4,14.48 v1(49.4,13.13)
  Top Layer w0.203: 34.59,25.97 32.5,23.88 19.71,23.88 18.67,24.92 RN6.6
  Top Layer w0.254: C10.2 34.59,27.45 34.59,25.97
  Bottom Layer w0.178: v1(49.4,13.13) 46.89,15.65 U2.9 46.89,16.74 44.2,19.43 41.66,19.43 35.12,25.97 34.59,25.97
ADC_IN4: length 23.7
  Top Layer w0.178: U13.15 51.31,15.75 49.91,14.35 v1(49.91,13.59)
  Top Layer w0.203: RN5.8 44.63,25.99 44.61,25.97
  Top Layer w0.254: C11.2 44.61,27.59 44.61,25.97
  Bottom Layer w0.178: 44.61,25.97 47.89,22.69 U2.8 47.89,15.61 v1(49.91,13.59)
ADC_IN5: length 30.7
  Top Layer w0.178: v1(50.42,13.13) 50.42,14.22 51.81,15.62 U13.14
  Top Layer w0.203: RN5.5 50.61,24.51 53.21,24.51 54.63,25.92 54.63,25.97
  Top Layer w0.254: 54.63,25.97 54.63,27.48 C12.2
  Bottom Layer w0.178: 54.63,25.97 53.17,24.51 50.55,24.51 48.89,22.85 U2.7 48.89,15.47 50.42,13.94 v1(50.42,13.13)
ADC_IN6: length 45.2
  Top Layer w0.178: v1(50.93,13.59) 50.93,14.1 52.31,15.48 U13.13
  Top Layer w0.203: 64.64,25.97 66.36,24.26 77.44,24.26 78.11,24.92 RN4.7
  Top Layer w0.254: C13.2 64.64,27.5 64.64,25.97
  Bottom Layer w0.178: v1(50.93,13.59) 50.93,14.22 49.89,15.26 U2.6 49.89,16.74 53.09,19.94 55.63,19.94 59.94,24.26 59.94,25.91 61.21,27.18 63.43,27.18 64.64,25.97
ADC_IN7: length 40.6
  Top Layer w0.178: U13.12 52.72,15.26 51.44,13.97 v1(51.44,13.13)
  Top Layer w0.203: RN4.8 75.15,25.48 74.66,25.97
  Top Layer w0.254: 74.66,25.97 74.66,27.51 74.11,28.07
  Bottom Layer w0.178: 74.66,25.97 73.08,24.38 60.96,24.38 55.88,19.3 53.47,19.3 50.89,16.72 U2.5 50.89,15.03 51.44,14.48 v1(51.44,13.13)
ADC_IN8: length 51.2
  Top Layer w0.178: U13.11 52.86,14.76 51.94,13.84 v1(51.94,13.59)
  Top Layer w0.203: 84.68,25.97 83.21,24.51 79.98,24.51 79.11,25.38 RN4.5
  Top Layer w0.254: 84.68,25.97 84.68,27.53 C15.2
  Bottom Layer w0.178: v1(51.94,13.59) 51.94,16.1 U2.4 51.89,16.71 53.85,18.67 56.13,18.67 61.21,23.75 82.46,23.75 84.68,25.97
ADC_IN9: length 71.8
  Top Layer w0.178: U13.10 52.99,14.26 52.45,13.72 v1(52.45,13.13)
  Top Layer w0.203: RN4.6 78.61,24.92 79.65,23.88 92.6,23.88 94.7,25.97
  Top Layer w0.254: 94.7,25.97 94.7,27.54 C16.2
  Bottom Layer w0.178: v1(52.45,13.13) 52.45,14.48 52.89,14.91 U2.3 52.89,16.69 54.23,18.03 56.39,18.03 61.47,23.11 91.84,23.11 94.7,25.97
I2C_SCL: length 2.8
  Top Layer w0.203: U13.45 50.81,7.25 50.55,6.98 v1(50.42,6.98)
  Bottom Layer w0.203: v1(49.28,6.6) 49.66,6.98 v1(50.42,6.98)
I2C_SDA: length 2.2
  Top Layer w0.203: J2.2 51.77,6.78 51.31,7.24 U13.46
LED0: length 51.5
  Top Layer w0.178: v1(47.12,12.26) U13.31
  Top Layer w0.203: L1.1 2.41,19.76 v1(2.41,18.92)
  Inner1 w0.178: v1(2.41,18.92) 2.79,18.54 37.21,18.54 38.1,17.65 38.1,15.49 41.33,12.26 v1(47.12,12.26)
  Bottom Layer w0.178: v1(47.12,12.26) 47.12,12.32
LED1: length 40.1
  Top Layer w0.178: U13.30 v1(46.61,12.76)
  Top Layer w0.203: L2.1 12.5,19.79 v1(12.5,19.05)
  Inner1 w0.178: v1(12.5,19.05) 37.46,19.05 38.61,17.91 38.61,15.75 41.6,12.76 v1(46.61,12.76)
  Bottom Layer w0.178: v1(46.61,12.76) 46.61,12.7
LED2: length 32.5
  Top Layer w0.178: v1(47.12,13.26) U13.29
  Top Layer w0.203: v1(21.49,19.56) 22.27,19.56 L3.1
  Inner1 w0.178: v1(47.12,13.26) 41.86,13.26 39.12,16 39.12,18.16 37.72,19.56 v1(21.49,19.56)
  Bottom Layer w0.178: v1(47.12,13.26) 47.12,13.33
LED3: length 21.4
  Top Layer w0.178: U13.28 v1(46.61,13.76)
  Top Layer w0.203: v1(31.5,20.06) 32.29,20.06 L4.1
  Inner1 w0.178: v1(46.61,13.76) 42.12,13.76 39.62,16.26 39.62,18.41 37.97,20.07 31.5,20.07
LED4: length 14.5
  Top Layer w0.178: v1(47.12,14.26) U13.27
  Top Layer w0.203: L5.1 41.39,19.8 40.36,18.77 v1(40.36,16.89)
  Inner1 w0.178: v1(40.36,16.89) 40.36,16.28 42.38,14.26 v1(47.12,14.26)
LED5: length 12.9
  Top Layer w0.178: v1(44.07,14.76) 45.31,14.76
  Top Layer w0.203: L6.1 51.84,20.57 v1(51.31,20.57)
  Inner1 w0.178: v1(44.07,14.76) 44.07,15.37 49.28,20.57 v1(51.31,20.57)
LED6: length 21.1
  Top Layer w0.178: v1(46.61,14.76) 46.11,15.26 U13.25
  Top Layer w0.203: v1(61.47,20.07) 62.26,20.07 L7.1
  Inner1 w0.178: v1(61.47,20.07) 49.53,20.07 46.61,17.14 v1(46.61,14.76)
LED7: length 32.6
  Top Layer w0.178: v1(47.81,13.74) U13.22
  Top Layer w0.203: v1(71.5,19.56) 72.31,19.56 L8.1
  Inner1 w0.178: 71.5,19.56 49.71,19.56 47.81,17.66 v1(47.81,13.74)
LED8: length 42.9
  Top Layer w0.178: v1(48.31,13.28) U13.21
  Top Layer w0.203: L9.1 v1(81.53,19.8)
  Inner1 w0.178: v1(48.31,13.28) 48.31,17.42 49.94,19.05 80.78,19.05 v1(81.53,19.8)
  Bottom Layer w0.203: v1(81.53,19.8) 81.53,19.81
LED9: length 53.2
  Top Layer w0.178: v1(48.81,12.83) U13.20
  Top Layer w0.203: L10.1 v1(91.57,19.8)
  Inner1 w0.178: v1(48.81,12.83) 48.81,17.16 50.19,18.54 90.31,18.54 v1(91.57,19.8)
SWCLK: length 10.1
  Top Layer w0.203: U13.37 46.81,7.19 43.92,4.29 39.42,4.29 D1.2
SWDIO: length 9
  Top Layer w0.203: 45.31,10.78 41.49,10.78 40.51,9.8 40.51,8.15 39.12,6.76 39.12,6.55
UART_RX: length 2.5
  Top Layer w0.203: J2.3 50.17,6.24 49.81,6.6 U13.43
UART_TX: length 3.3
  Top Layer w0.203: J1.3 47.51,6.53 47.99,7.01 48.92,7.01 49.31,7.4 U13.42
$1N7041: length 5.6
  Top Layer w0.203: RST.3 55.84,8.9 55.84,10.6 C5.2 55.14,11.87 55.14,12.42 54.8,12.76 U13.7
$1N7104: length 2.7
  Top Layer w0.203: U13.32 44.2,11.76 43.29,12.67 FUNC.1
$1N7880: length 3.6
  Top Layer w0.203: J3.2 50.93,5.23 arc(50.99,5.35) J2.1
$1N7885: length 3.6
  Top Layer w0.203: J3.3 48.39,5.14 arc(48.33,5.32) J1.1
$1N11035: length 3.7
  Top Layer w0.203: RN8.8 50.24,23.72 S6.2
$1N11042: length 6.3
  Top Layer w0.203: RN8.5 43.92,23.72 S5.2
$1N11122: length 6.6
  Top Layer w0.203: S8.2 73.34,20.65 75.64,20.65 77.19,22.2 RN9.5
$1N11129: length 17.5
  Top Layer w0.203: RN9.6 78.11,22.72 77.33,23.49 63.73,23.49 S7.2
$1N11138: length 14.8
  Top Layer w0.203: RN9.7 78.61,22.7 79.14,23.24 90.78,23.24 S10.2
$1N11160: length 3.2
  Top Layer w0.203: S9.2 81.81,22.2 RN9.8
$1N11201: length 6.8
  Top Layer w0.203: RN7.5 16.99,22.2 15.42,20.62 13.26,20.62 S2.2
$1N11208: length 17.6
  Top Layer w0.203: RN7.6 18.17,22.73 17.53,23.37 3.5,23.37 S1.2
$1N11217: length 14.7
  Top Layer w0.203: S4.2 30.68,23.24 19.18,23.24 18.67,22.73 RN7.7
$1N11224: length 3
  Top Layer w0.203: RN7.8 21.71,22.2 S3.2
$1N12791: length 3.8
  Top Layer w0.203: L2.2 15.88,19.81 16.43,19.26 RN1.8
$1N12820: length 15.1
  Top Layer w0.203: RN1.7 18.17,18.9 17.8,18.54 5.32,18.54 L1.2
$1N12849: length 5.4
  Top Layer w0.203: L3.2 23.34,19.02 19.4,19.02 RN1.5
$1N12851: length 16.5
  Top Layer w0.203: RN1.6 18.67,18.9 19.03,18.54 32.89,18.54 L4.2
$1N12907: length 6.2
  Top Layer w0.203: L6.2 53.33,18.92 51.56,18.92 49.7,20.78 RN2.1
$1N12909: length 3.9
  Top Layer w0.203: RN2.4 46.18,20.78 45.21,19.81 L5.2
$1N13108: length 15
  Top Layer w0.203: RN3.7 78.11,18.9 77.75,18.54 65.39,18.54 L7.2
$1N13110: length 3.7
  Top Layer w0.203: RN3.8 76.25,19.26 75.7,19.81 L8.2
$1N13112: length 5.5
  Top Layer w0.203: L9.2 83.41,19.02 79.34,19.02 RN3.5
$1N13114: length 16.6
  Top Layer w0.203: RN3.6 78.61,18.9 78.97,18.54 92.96,18.54 L10.2

## Copper pours and planes (outline as drawn; the poured copper is in the pictures)
GND on Inner2: 0.26,29.08 96.42,29.08 96.42,0.26 0.26,0.26

Small or netless copper shapes (teardrops, artwork), in the pictures only: 305 on Top Layer, 44 on Bottom Layer, 23 on Inner1, 80 on Inner2

## Text on the board
Bottom Silkscreen Layer: JLCJLCJLCJLC | 十路灰度传感器 | Design by Jsir2022 | 5V / TX/SCL / RX/SDA / GND | GND / SWDIO / SWCLK / 5V
Top Silkscreen Layer: UART/I2C

# Board v1
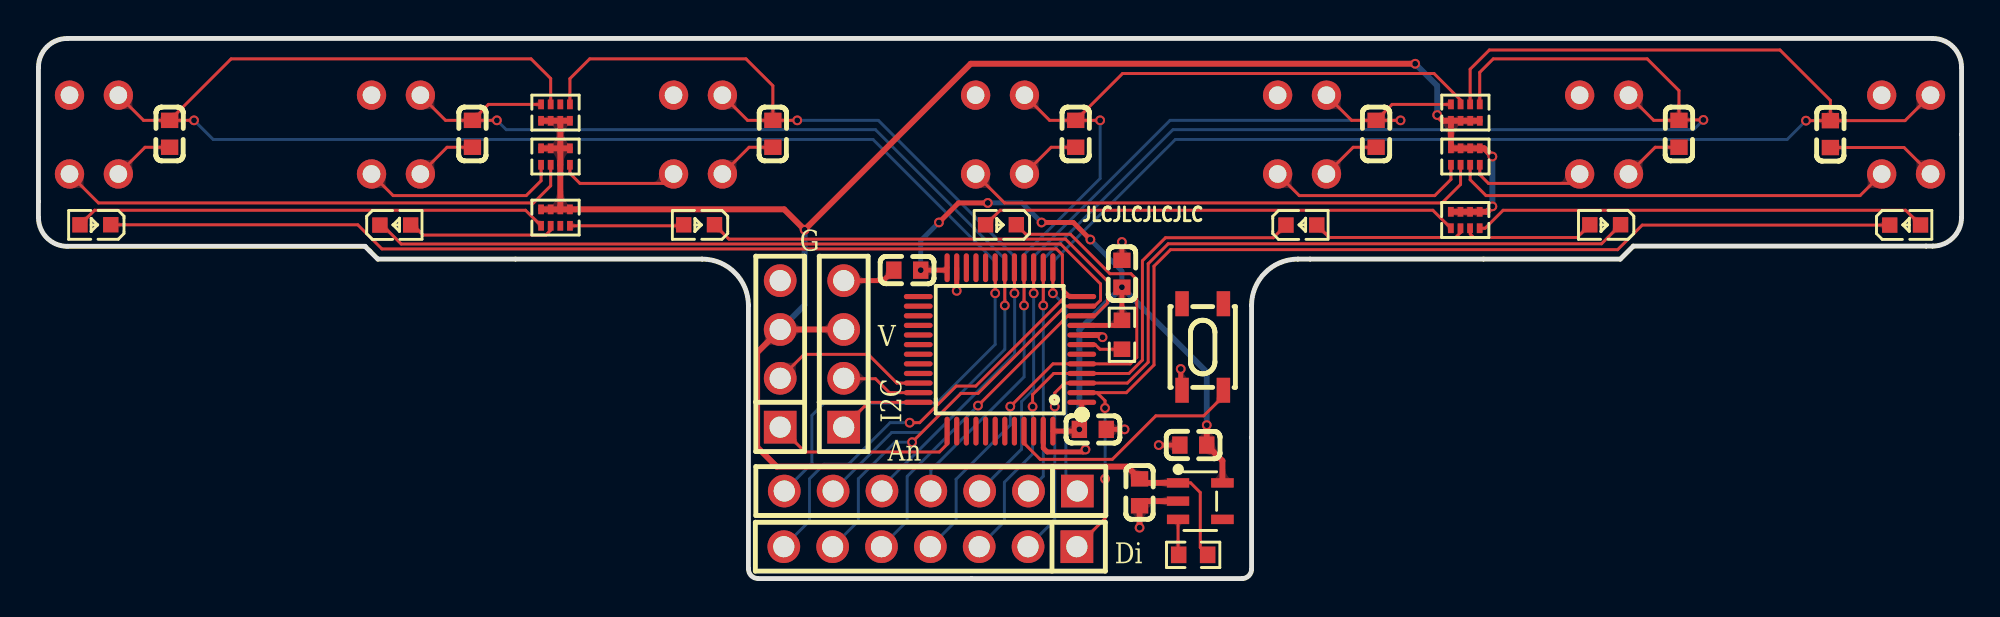
[diagram p4: board, top side]
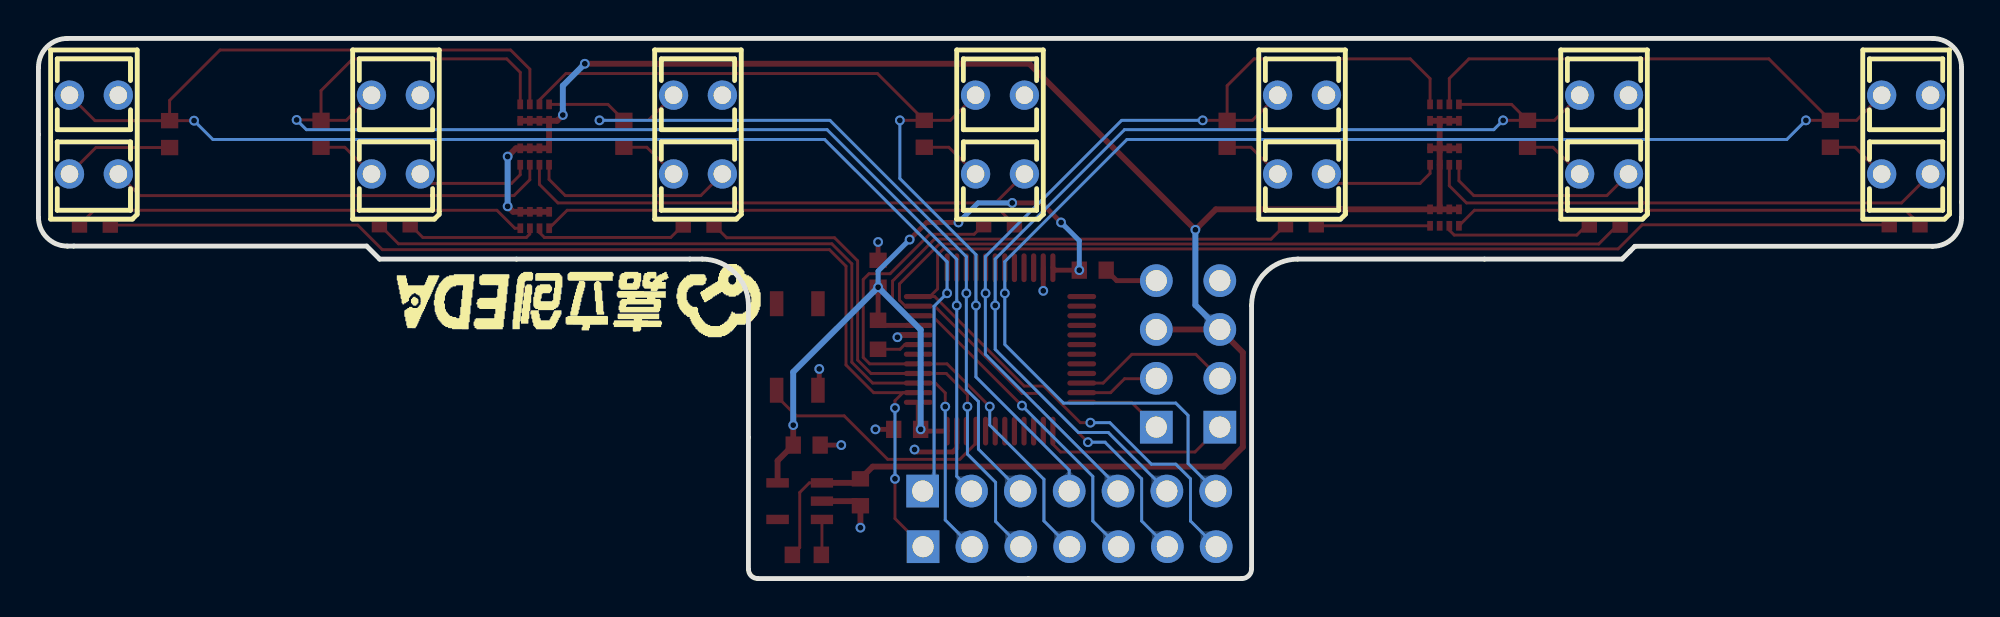
[diagram p5: board, bottom side, seen from below]

Outline 100 x 28.09 mm; copper layers: Top Layer, Bottom Layer. Coordinates in mm from the lower left corner of the outline.
Outline path: 0,26.59 arc(0.44,27.65) 1.5,28.09 98.5,28.09 arc(99.56,27.65) 100,26.59 100,18.79 arc(99.56,17.73) 98.5,17.29 82.93,17.29 82.26,16.62 65.49,16.62 arc(63.79,15.91) 63.08,14.2 63.08,0.49 arc(62.94,0.14) 62.59,0 37.43,0 arc(37.07,0.15) 36.92,0.51 36.92,14.2 arc(36.21,15.91) 34.51,16.62 17.65,16.62 16.98,17.28 1.5,17.28 arc(0.44,17.72) 0,18.78 0,26.59
Stack: Top Layer 0.035mm / Dielectric1 1.51mm FR4 er 4.5 / Bottom Layer 0.035mm

## Design rules (mm)
template: JLCPCB Capability(Two Layers Board)
spacing copperThickness1oz (default): track to track 0.102, other pairs 0.152 to 0.3
spacing copperThickness2oz: track to track 0.203, other pairs 0.152 to 0.3
track width copperThickness1oz (default): min 0.127, default 0.254, max 2.54
track width copperThickness2oz: min 0.203, default 0.254, max 2.54
differential pair differentialPair (default): width min 0.127, default 0.254, max 2.54; gap min 0.152, default 0.152
via viaSize (default): diameter min 0.5, default 0.61, max 10; hole min 0.3, default 0.305, max 6.3

## Placement (name value [footprint] x y rotation side)
C1  1uF  [C0603]  57.26 4.49 90 top
C2  100nF  [C0603]  54.83 7.76 180 top
C3  100nF  [C0603]  56.34 15.85 270 top
C4  100nF  [C0603]  45.18 16.04 0 top
C5  1uF  [C0603]  60.05 6.94 0 top
C6  100pF  [C0603]  93.18 23.12 90 top
C7  100pF  [C0603]  85.31 23.13 90 top
C8  100pF  [C0603]  69.56 23.13 90 top
C9  100pF  [C0603]  53.94 23.13 90 top
C10  100pF  [C0603]  38.19 23.13 90 top
C11  100pF  [C0603]  22.57 23.13 90 top
C12  100pF  [C0603]  6.82 23.13 90 top
H1  -  [HDR-TH_4P-P2.54-V-M]  41.87 11.69 90 top
H2  -  [HDR-TH_4P-P2.54-V-M]  38.57 11.69 90 top
H3  -  [HDR-TH_7P-P2.54-V-M]  46.4 4.55 180 top
H4  -  [HDR-TH_7P-P2.54-V-M]  46.38 1.66 180 top
LED1  -  [LED_0603]  97.12 18.39 0 top
LED2  -  [LED_0603]  81.42 18.39 180 top
LED3  -  [LED_0603]  65.72 18.39 0 top
LED4  -  [LED_0603]  50 18.39 180 top
LED5  -  [LED_0603]  34.3 18.39 180 top
LED6  -  [LED_0603]  18.61 18.39 0 top
LED7  -  [LED_0603]  2.91 18.39 180 top
R1  10K  [R0603]  56.34 12.68 270 top
R2  10K  [R0603]  60.04 1.23 180 top
RN1  10K  [RES-ARRAY-SMD_0402-8P-L2.0-W1.0-BL]  26.89 24.24 180 top
RN2  10K  [RES-ARRAY-SMD_0402-8P-L2.0-W1.0-BL]  74.2 24.24 180 top
RN3  1K  [RES-ARRAY-SMD_0402-8P-L2.0-W1.0-BL]  74.19 18.65 180 top
RN4  1K  [RES-ARRAY-SMD_0402-8P-L2.0-W1.0-BL]  26.89 18.78 180 top
RN5  330Ω  [RES-ARRAY-SMD_0402-8P-L2.0-W1.0-BL]  74.2 21.95 0 top
RN6  330Ω  [RES-ARRAY-SMD_0402-8P-L2.0-W1.0-BL]  26.89 21.95 0 top
SW1  TS-1089S-AR02516  [SW-SMD_4P-L4.2-W3.3-P2.15-LS5.1]  60.54 12.04 90 top
U1  STM32F031C6T6  [LQFP-48_L7.0-W7.0-P0.50-LS9.0-BL]  50 11.92 90 top
U2  RT9013-33GB  [SOT-23-5_L3.0-W1.7-P0.95-LS2.8-BL]  60.41 4.03 270 top
U3  ITR9909  [OPTO-TH_ITR9909]  97.12 23.09 90 bottom
U4  ITR9909  [OPTO-TH_ITR9909]  81.41 23.09 90 bottom
U5  ITR9909  [OPTO-TH_ITR9909]  65.71 23.09 90 bottom
U6  ITR9909  [OPTO-TH_ITR9909]  50 23.09 90 bottom
U7  ITR9909  [OPTO-TH_ITR9909]  34.29 23.09 90 bottom
U8  ITR9909  [OPTO-TH_ITR9909]  18.59 23.09 90 bottom
U9  ITR9909  [OPTO-TH_ITR9909]  2.88 23.09 90 bottom

## Footprints (pads in the part's own frame, mm; a bottom-side part is the same pattern mirrored in y, then rotated)
C0603
  rect 0.8x0.9 smd: 1(-0.7,0) 2(0.7,0)
HDR-TH_4P-P2.54-V-M
  rect 1.7x1.7 hole 1.1: 1(-3.81,0)
  round 1.7 hole 1.1: 2(-1.27,0) 3(1.27,0) 4(3.81,0)
HDR-TH_7P-P2.54-V-M
  rect 1.7x1.7 hole 1.1: 1(-7.62,0)
  round 1.7 hole 1.1: 2(-5.08,0) 3(-2.54,0) 4(0,0) 5(2.54,0) 6(5.08,0) 7(7.62,0)
LED_0603
  rect 0.8x0.8 smd: 1(-0.851,-0.01) 2(0.75,-0.005)
LQFP-48_L7.0-W7.0-P0.50-LS9.0-BL
  oval 0.27x1.5 smd: 1(-2.75,-4.25) 2(-2.25,-4.25) 3(-1.75,-4.25) 4(-1.25,-4.25) 5(-0.75,-4.25) 6(-0.25,-4.25) 7(0.25,-4.25) 8(0.75,-4.25) 9(1.25,-4.25) 10(1.75,-4.25) 11(2.25,-4.25) 12(2.75,-4.25) 25(2.75,4.25) 26(2.25,4.25) 27(1.75,4.25) 28(1.25,4.25) 29(0.75,4.25) 30(0.25,4.25) 31(-0.25,4.25) 32(-0.75,4.25) 33(-1.25,4.25) 34(-1.75,4.25) 35(-2.25,4.25) 36(-2.75,4.25)
  oval 1.5x0.27 smd: 13(4.25,-2.75) 14(4.25,-2.25) 15(4.25,-1.75) 16(4.25,-1.25) 17(4.25,-0.75) 18(4.25,-0.25) 19(4.25,0.25) 20(4.25,0.75) 21(4.25,1.25) 22(4.25,1.75) 23(4.25,2.25) 24(4.25,2.75) 37(-4.25,2.75) 38(-4.25,2.25) 39(-4.25,1.75) 40(-4.25,1.25) 41(-4.25,0.75) 42(-4.25,0.25) 43(-4.25,-0.25) 44(-4.25,-0.75) 45(-4.25,-1.25) 46(-4.25,-1.75) 47(-4.25,-2.25) 48(-4.25,-2.75)
OPTO-TH_ITR9909
  round 1.524 hole 0.914: 1(-2.05,1.27) 2(-2.05,-1.27) 3(2.05,-1.27) 4(2.05,1.27)
R0603
  rect 0.806x0.864 smd: 1(-0.753,0) 2(0.753,0)
RES-ARRAY-SMD_0402-8P-L2.0-W1.0-BL
  rect 0.3x0.505 smd: 1(-0.75,0.427) 2(-0.25,0.427) 3(0.25,0.427) 4(0.75,0.427) 5(0.75,-0.427) 6(0.25,-0.427) 7(-0.25,-0.427) 8(-0.75,-0.427)
SOT-23-5_L3.0-W1.7-P0.95-LS2.8-BL
  rect 0.49x1.157 smd: 1(-0.95,-1.153) 2(0,-1.153) 3(0.95,-1.153)
  rect 0.49x1.175 smd: 4(0.95,1.153) 5(-0.95,1.153)
SW-SMD_4P-L4.2-W3.3-P2.15-LS5.1
  rect 1.3x0.701 smd: 1(-2.251,1.075) 2(2.251,1.075) 3(-2.251,-1.075) 4(2.251,-1.075)

## Nets
As in the schematic.

Pads without a net: RN1 7; RN4 2; SW1 2 4; U1 6 20 21 22 25 26 27 28 29 30 31 32 33 38 39 40 41 42 43 44 46; U2 4

## Via types
v1: diameter 0.508, hole 0.305, Top Layer to Bottom Layer, 43 vias

## Routing (per net, layer and track width the routed paths; a pad name or vN(x,y) marks a point on that pad's centre or on a via; arc(x,y) is an arc through that point)
D3.3V: length 44
  Top Layer w0.254: U1.24 47.12,16.04 v1(45.88,16.04) ; v1(46.82,18.52) 47.84,19.54 v1(49.37,19.54) ; U1.48 54.03,7.67 v1(54.13,7.76) 54.25,7.88 U1.1 ; v1(54.7,17.63) 53.81,18.52 v1(52.16,18.52) ; v1(56.34,15.15) 56.34,13.44 R1.1 56.08,13.17 U1.9
  Top Layer w0.305: v1(60.75,7.98) C5.2 61.57,6.13 U2.5
  Bottom Layer w0.254: v1(56.34,15.15) 56.34,15.99 v1(54.7,17.63) ; v1(49.37,19.54) 51.14,19.54 v1(52.16,18.52) ; v1(45.88,16.04) 45.88,17.57 v1(46.82,18.52)
  Bottom Layer w0.305: v1(60.75,7.98) 60.75,10.74 v1(56.34,15.15) 54.13,12.94 v1(54.13,7.76)
D5V: length 114.2
  Top Layer w0.152: R2.1 60.41,1.62 60.41,4.48 59.91,4.98 U2.1
  Top Layer w0.305: 74.95,23.81 RN2.2 RN2.4 ; RN4.7 RN4.8 38.78,19.2 v1(39.84,18.14) 48.48,26.78 v1(71.59,26.78) ; RN4.7 RN4.6 RN4.5 ; RN4.7 RN6.6 RN6.3 ; RN2.4 73.45,22.38 RN5.2 RN5.4 75.18,22.38 v1(75.6,21.95) ; RN2.4 73.03,23.81 v1(72.73,24.11) ; RN1.2 RN6.3 ; RN1.2 RN1.3 RN1.4 ; RN1.2 RN1.1 ; RN6.3 RN6.4 ; RN6.3 RN6.2 RN6.1 ; v1(75.6,19.36) 75.32,19.08 RN3.8 RN3.7 RN3.6 RN3.5 ; H1.3 H2.3 37.37,11.76 37.37,6.84 38.39,5.82 56.62,5.82 C1.2 57.47,4.98 U2.1
  Bottom Layer w0.305: v1(71.59,26.78) 72.73,25.63 v1(72.73,24.11) ; v1(75.6,21.95) v1(75.6,19.36) ; v1(39.84,18.14) 39.84,14.23 H2.3
GND: length 40.9
  Top Layer w0.152: C9.1 52.66,22.43 U6.1 ; U3.1 97.01,22.42 C6.1 ; C11.1 21.25,22.43 U8.1 ; U5.1 68.37,22.43 C8.1 ; C7.1 84.07,22.43 U4.1 ; C10.1 36.95,22.43 U7.1 ; U9.1 5.54,22.43 C12.1
  Top Layer w0.254: C5.1 v1(58.25,6.94) ; U1.47 52.25,6.79 52.46,6.58 54.32,6.58 v1(54.44,6.71) ; v1(59.4,10.9) 59.4,9.86 SW1.1 ; U1.23 v1(47.75,14.97) ; C3.1 v1(56.34,17.51) ; C4.1 43.93,15.5 H1.4 ; C2.1 v1(56.48,7.76)
  Top Layer w0.305: U1.8 55.22,12.67 v1(55.33,12.55) ; U2.2 57.5,4.03 C1.1 v1(57.26,2.65)
  Bottom Layer w0.254: v1(58.25,6.94) 58.25,6.96 ; v1(56.48,7.76) 56.48,7.73
  Bottom Layer w0.305: v1(57.26,2.65) 57.24,2.65
ADC1_PA3: length 86.1
  Top Layer w0.152: 74.46,24.67 74.45,24.68 74.45,26.49 75.45,27.49 90.56,27.49 93.18,24.87 C6.2 ; C6.2 97.06,23.82 U3.4 ; C6.2 v1(91.91,23.82) ; U1.13 v1(52.75,14.84)
  Bottom Layer w0.152: v1(91.91,23.82) 90.93,22.84 59.12,22.84 52.75,16.47 v1(52.75,14.84) 53.43,14.16 53.43,5.14 H3.1
ADC2_PA4: length 70.6
  Top Layer w0.152: 74.95,24.69 74.95,26.33 75.65,27.03 83.66,27.03 85.31,25.38 C7.2 ; U4.4 83.99,23.83 C7.2 ; C7.2 85.33,23.86 v1(86.58,23.86) ; U1.14 v1(52.25,14.2)
  Bottom Layer w0.152: H3.2 52.25,5.32 v1(52.25,14.2) 52.25,16.61 58.99,23.35 86.07,23.35 v1(86.58,23.86)
ADC3_PA5: length 45.3
  Top Layer w0.152: U1.15 v1(51.75,14.84) ; C8.2 68.29,23.83 U5.4 ; C8.2 70.39,24.66 RN2.5 ; C8.2 v1(70.83,23.83)
  Bottom Layer w0.152: v1(70.83,23.83) 58.84,23.83 51.75,16.74 v1(51.75,14.84) 51.75,9.84 51.12,9.21 51.12,6.73 H3.3
ADC4_PA6: length 51.2
  Top Layer w0.152: U6.4 52.58,23.83 C9.2 ; C9.2 v1(55.21,23.83) ; C9.2 56.37,26.27 72.57,26.27 73.95,24.89 73.95,24.67 73.96,24.66 ; U1.16 v1(51.25,14.2)
  Bottom Layer w0.152: v1(51.25,14.2) 51.25,10.49 46.4,5.64 H3.4 ; v1(51.25,14.2) 51.25,16.85 55.21,20.81 v1(55.21,23.83) ; v1(51.25,14.2) 51.27,14.2
ADC5_PA7: length 49.8
  Top Layer w0.152: RN1.8 27.64,26 28.66,27.03 36.79,27.03 38.19,25.63 C10.2 ; U1.17 v1(50.75,14.84) ; C10.2 v1(39.46,23.83) ; C10.2 36.87,23.83 U7.4
  Bottom Layer w0.152: v1(39.46,23.83) 43.67,23.83 50.76,16.74 50.76,14.85 v1(50.75,14.84) 50.76,14.83 50.76,11.67 43.86,4.77 H3.5
ADC6_PB0: length 56.5
  Top Layer w0.152: RN1.5 23.4,24.66 C11.2 ; C11.2 v1(23.84,23.83) ; C11.2 21.17,23.83 U8.4 ; U1.18 v1(50.25,14.2)
  Bottom Layer w0.152: 23.84,23.86 v1(23.84,23.83) 24.32,23.35 43.52,23.35 50.25,16.62 v1(50.25,14.2) 50.25,11.92 45.93,7.6 44.37,7.6 H3.6
ADC7_PB1: length 93.3
  Top Layer w0.152: U9.4 5.46,23.83 C12.2 ; U1.19 v1(49.75,14.84) ; C12.2 10.02,27.03 25.62,27.03 26.64,26.01 RN1.6 ; C12.2 v1(8.09,23.83)
  Bottom Layer w0.152: H3.7 40.22,5.99 40.22,8.49 40.86,9.12 46.7,9.12 49.75,12.18 v1(49.75,14.84) 49.75,16.49 43.4,22.84 9.08,22.84 v1(8.09,23.83) 8.09,23.86
GPIO1_PC13: length 57.4
  Top Layer w0.152: 55.04,9.67 55.46,9.25 v1(55.46,8.87) ; 55.04,9.67 56.57,9.67 58.01,11.11 58.01,16.25 58.87,17.11 82.12,17.11 83.4,18.38 LED1.1 ; 55.04,9.67 U1.2 ; H4.1 55.46,3.12 v1(55.46,5.19)
  Bottom Layer w0.152: v1(55.46,5.19) v1(55.46,8.87)
GPIO2_PC14: length 44.6
  Top Layer w0.152: v1(52.85,8.94) 52.85,9.66 53.36,10.17 U1.3 56.62,10.17 57.71,11.25 57.71,16.37 58.74,17.41 81.28,17.41 82.27,18.4
  Bottom Layer w0.152: H4.2 52.85,3.05 v1(52.85,8.94)
GPIO3_PC15: length 28.9
  Top Layer w0.152: v1(51.69,8.94) 51.69,9.57 52.79,10.67 U1.4 56.71,10.67 57.4,11.37 57.4,16.53 58.6,17.73 64.21,17.73 LED3.1
  Bottom Layer w0.152: H4.3 50.23,2.97 50.23,5.01 51.69,6.48 v1(51.69,8.94)
GPIO4_PF0: length 28.1
  Top Layer w0.152: LED4.1 51.35,17.91 53.66,17.91 55.72,15.85 56.81,15.85 57.11,15.56 57.11,11.5 56.78,11.17 U1.5 52.75,11.17 v1(50.53,8.95)
  Bottom Layer w0.152: H4.4 47.71,2.99 47.71,5.16 50.53,7.98 v1(50.53,8.95)
GPIO5_PA0: length 41.2
  Top Layer w0.152: 54.28,13.7 54.95,13.7 55.59,14.33 55.59,15.47 53.41,17.65 35.9,17.65 LED5.1 ; 54.28,13.7 53.56,13.7 v1(48.86,9) ; 54.28,13.7 U1.10
  Bottom Layer w0.152: H4.5 45.17,2.99 45.17,5.31 v1(48.86,9)
GPIO6_PA1: length 60.2
  Top Layer w0.152: 17.75,18.51 18.87,17.4 53.15,17.4 55.23,15.33 55.23,14.48 54.92,14.17 U1.11 53.39,14.17 48.86,9.63 47.97,9.63 v1(45.43,7.09)
  Bottom Layer w0.152: v1(45.43,7.09) 44.54,7.09 42.63,5.19 42.63,2.99 H4.6
GPIO7_PA2: length 74.6
  Top Layer w0.152: v1(45.3,8.11) 45.82,8.11 47.72,10.01 48.74,10.01 53.4,14.67 53.64,14.67 ; 3.76,18.4 16.61,18.4 17.86,17.15 52.94,17.15 53.24,16.84 53.24,15.07 53.64,14.67 ; 53.64,14.67 U1.12
  Bottom Layer w0.152: v1(45.3,8.11) 44.28,8.11 42.13,5.95 40.86,5.95 40.09,5.19 40.09,2.99 H4.7
SCL_PF6: length 4.2
  Top Layer w0.152: U1.35 44.25,9.67 43.52,10.39 41.89,10.39 H1.2
SDA_PF7: length 4.4
  Top Layer w0.152: U1.36 43.16,9.17 H1.1
SWCLK_PA14: length 9.4
  Top Layer w0.152: 47.25,6.98 46.85,6.58 39.86,6.58 H2.1
SWDIO_PA13: length 8.3
  Top Layer w0.152: U1.34 44.64,10.17 43.14,11.66 39.82,11.66 H2.2
$1N2447: length 2.2
  Top Layer w0.152: R1.2 55.2,11.93 54.96,12.17 U1.7
$1N4175: length 23.6
  Top Layer w0.152: LED1.2 97.1,19.16 76.16,19.16 75.23,18.22 RN3.1
$1N4229: length 6.8
  Top Layer w0.152: 74.45,18.13 74.45,17.92 74.63,17.74 80.01,17.74 LED2.2
$1N4256: length 8.1
  Top Layer w0.152: LED3.2 67.12,17.74 73.69,17.74 73.94,17.99 73.94,18.21 73.94,18.21
$1N4283: length 24.9
  Top Layer w0.152: RN3.4 72.51,19.16 50.01,19.16 LED4.2
$1N4310: length 5.9
  Top Layer w0.152: LED5.2 33.5,18.35 RN4.1
$1N5229: length 13
  Top Layer w0.152: SW1.3 61.62,9.49 60.59,8.46 58.1,8.46 55.84,6.2 52.09,6.2 51.25,7.04 U1.45
$1N5545: length 1.9
  Top Layer w0.152: 59.29,1.23 59.26,1.26 U2.3
$1N6315: length 27.3
  Top Layer w0.152: RN5.7 73.95,20.5 72.99,19.54 50.24,19.54 U6.2
$1N6322: length 10.6
  Top Layer w0.152: 73.45,21.52 73.45,20.76 72.61,19.92 65.56,19.92 U5.2
$1N6336: length 6.1
  Top Layer w0.152: U4.2 79.65,20.55 75.4,20.55 74.95,21 RN5.5
$1N6418: length 23
  Top Layer w0.152: 95.85,21.04 94.72,19.92 75.27,19.92 74.45,20.74 74.45,21.52
$1N6450: length 6.3
  Top Layer w0.152: RN6.5 27.64,21.07 28.16,20.55 32.53,20.55 U7.2
$1N6471: length 10.4
  Top Layer w0.152: RN6.8 26.14,20.69 25.36,19.92 18.44,19.92 U8.2
$1N6478: length 27.1
  Top Layer w0.152: U9.2 3.12,19.54 25.74,19.54 26.64,20.43 RN6.7
$1N6514: length 24.6
  Top Layer w0.152: RN4.4 25.33,19.16 2.92,19.16 LED7.2
$1N6542: length 7.9
  Top Layer w0.152: RN4.3 26.64,18.12 26.38,17.87 20.01,17.87 19.36,18.52

## Copper pours and planes (outline as drawn; the poured copper is in the pictures)
GND on Bottom Layer: -7.66,35.41 104.74,35.41 104.74,-11.96 -7.66,-11.96

Small or netless copper shapes (teardrops, artwork), in the pictures only: 231 on Top Layer, 58 on Bottom Layer

## Text on the board
Top Silkscreen Layer: JLCJLCJLCJLC | G | V | An | Di | I2C
